# EasyEDA Pro project Project.eprj, board Backup
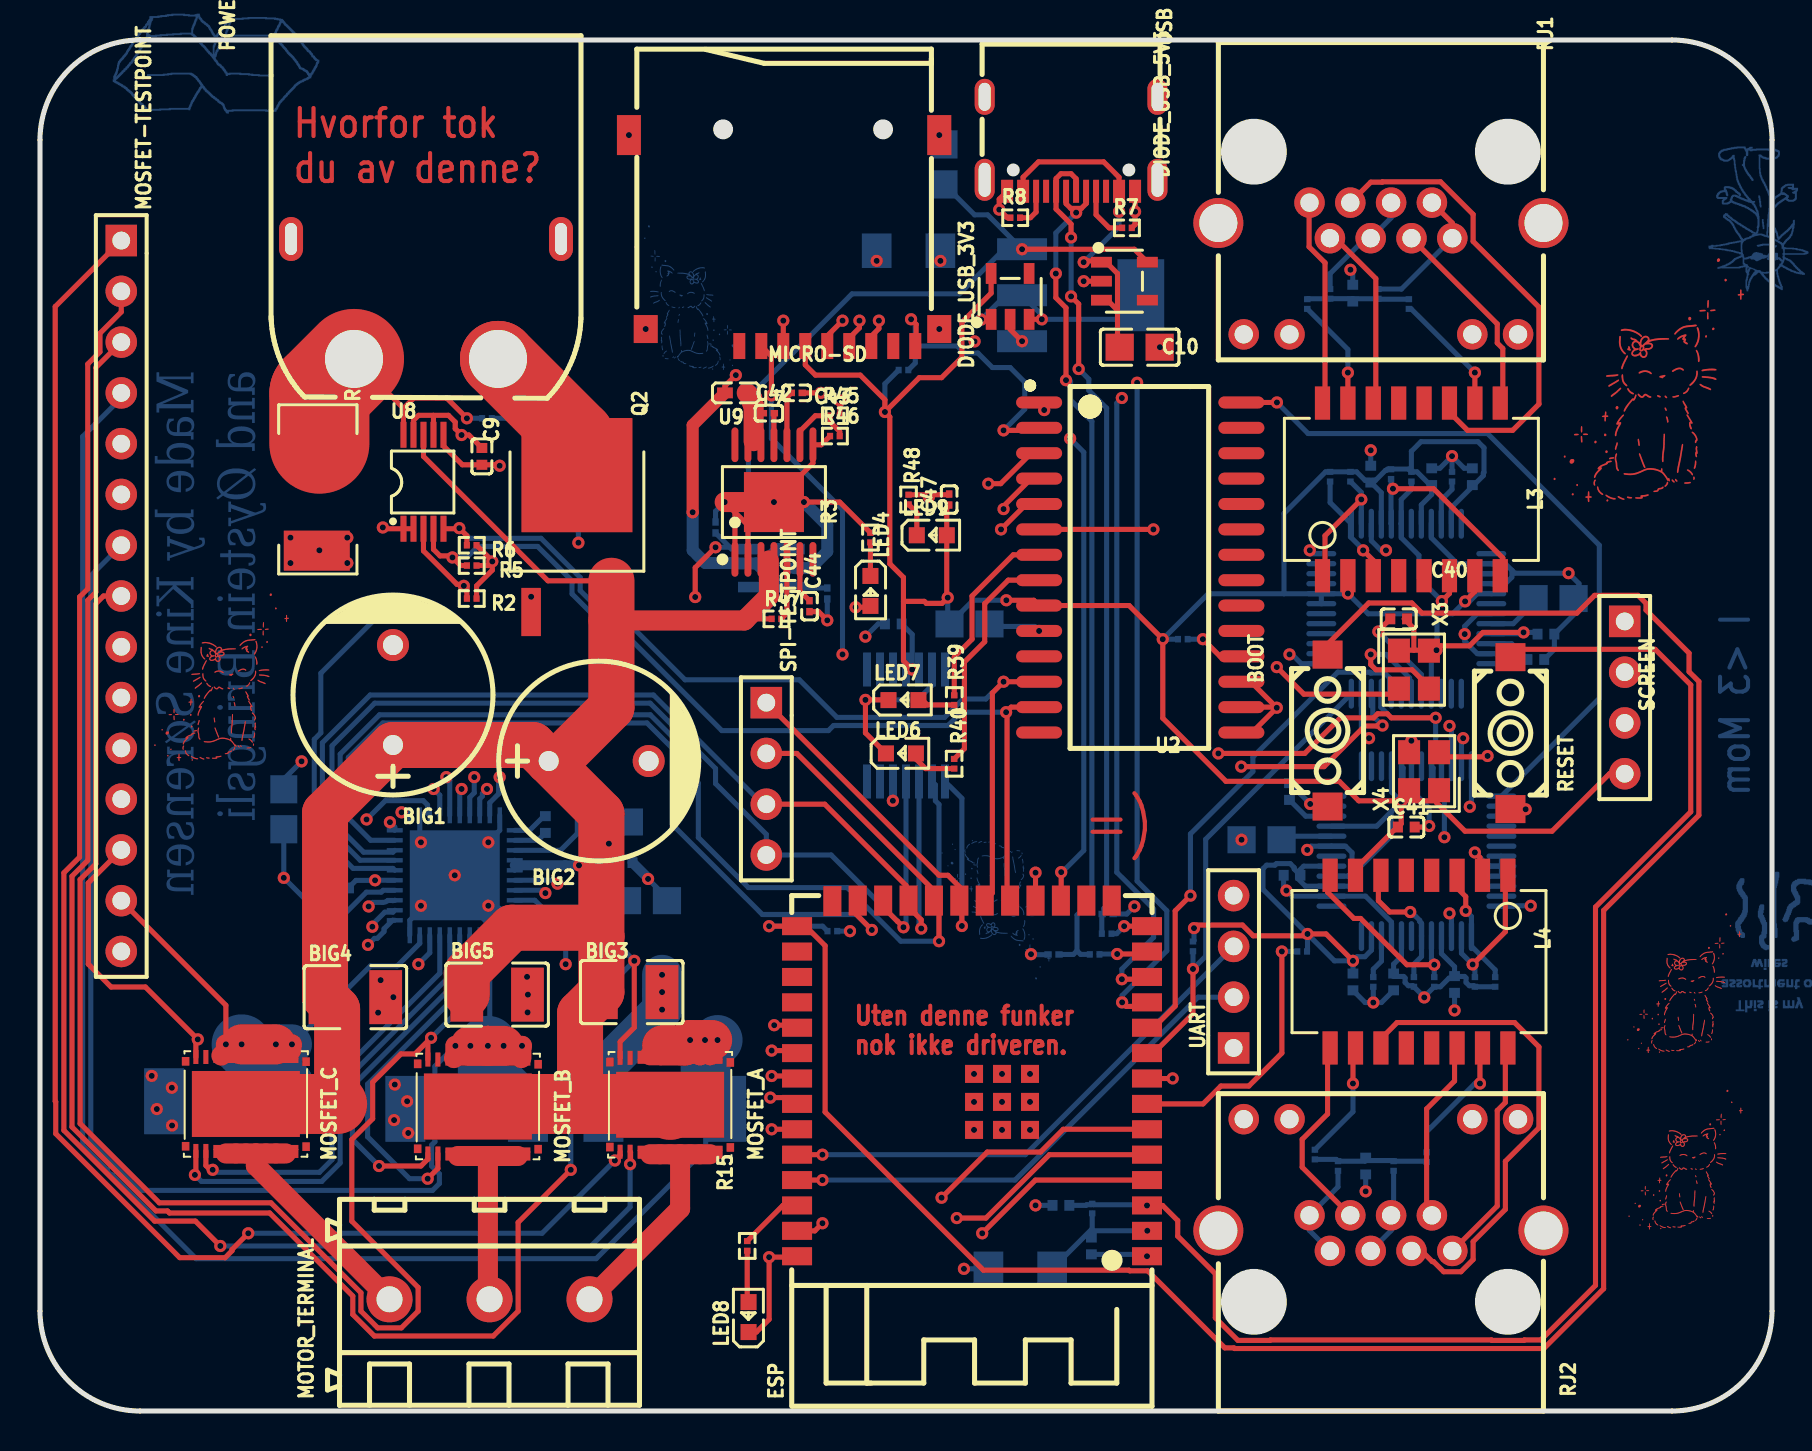
[diagram p5: board, top side]
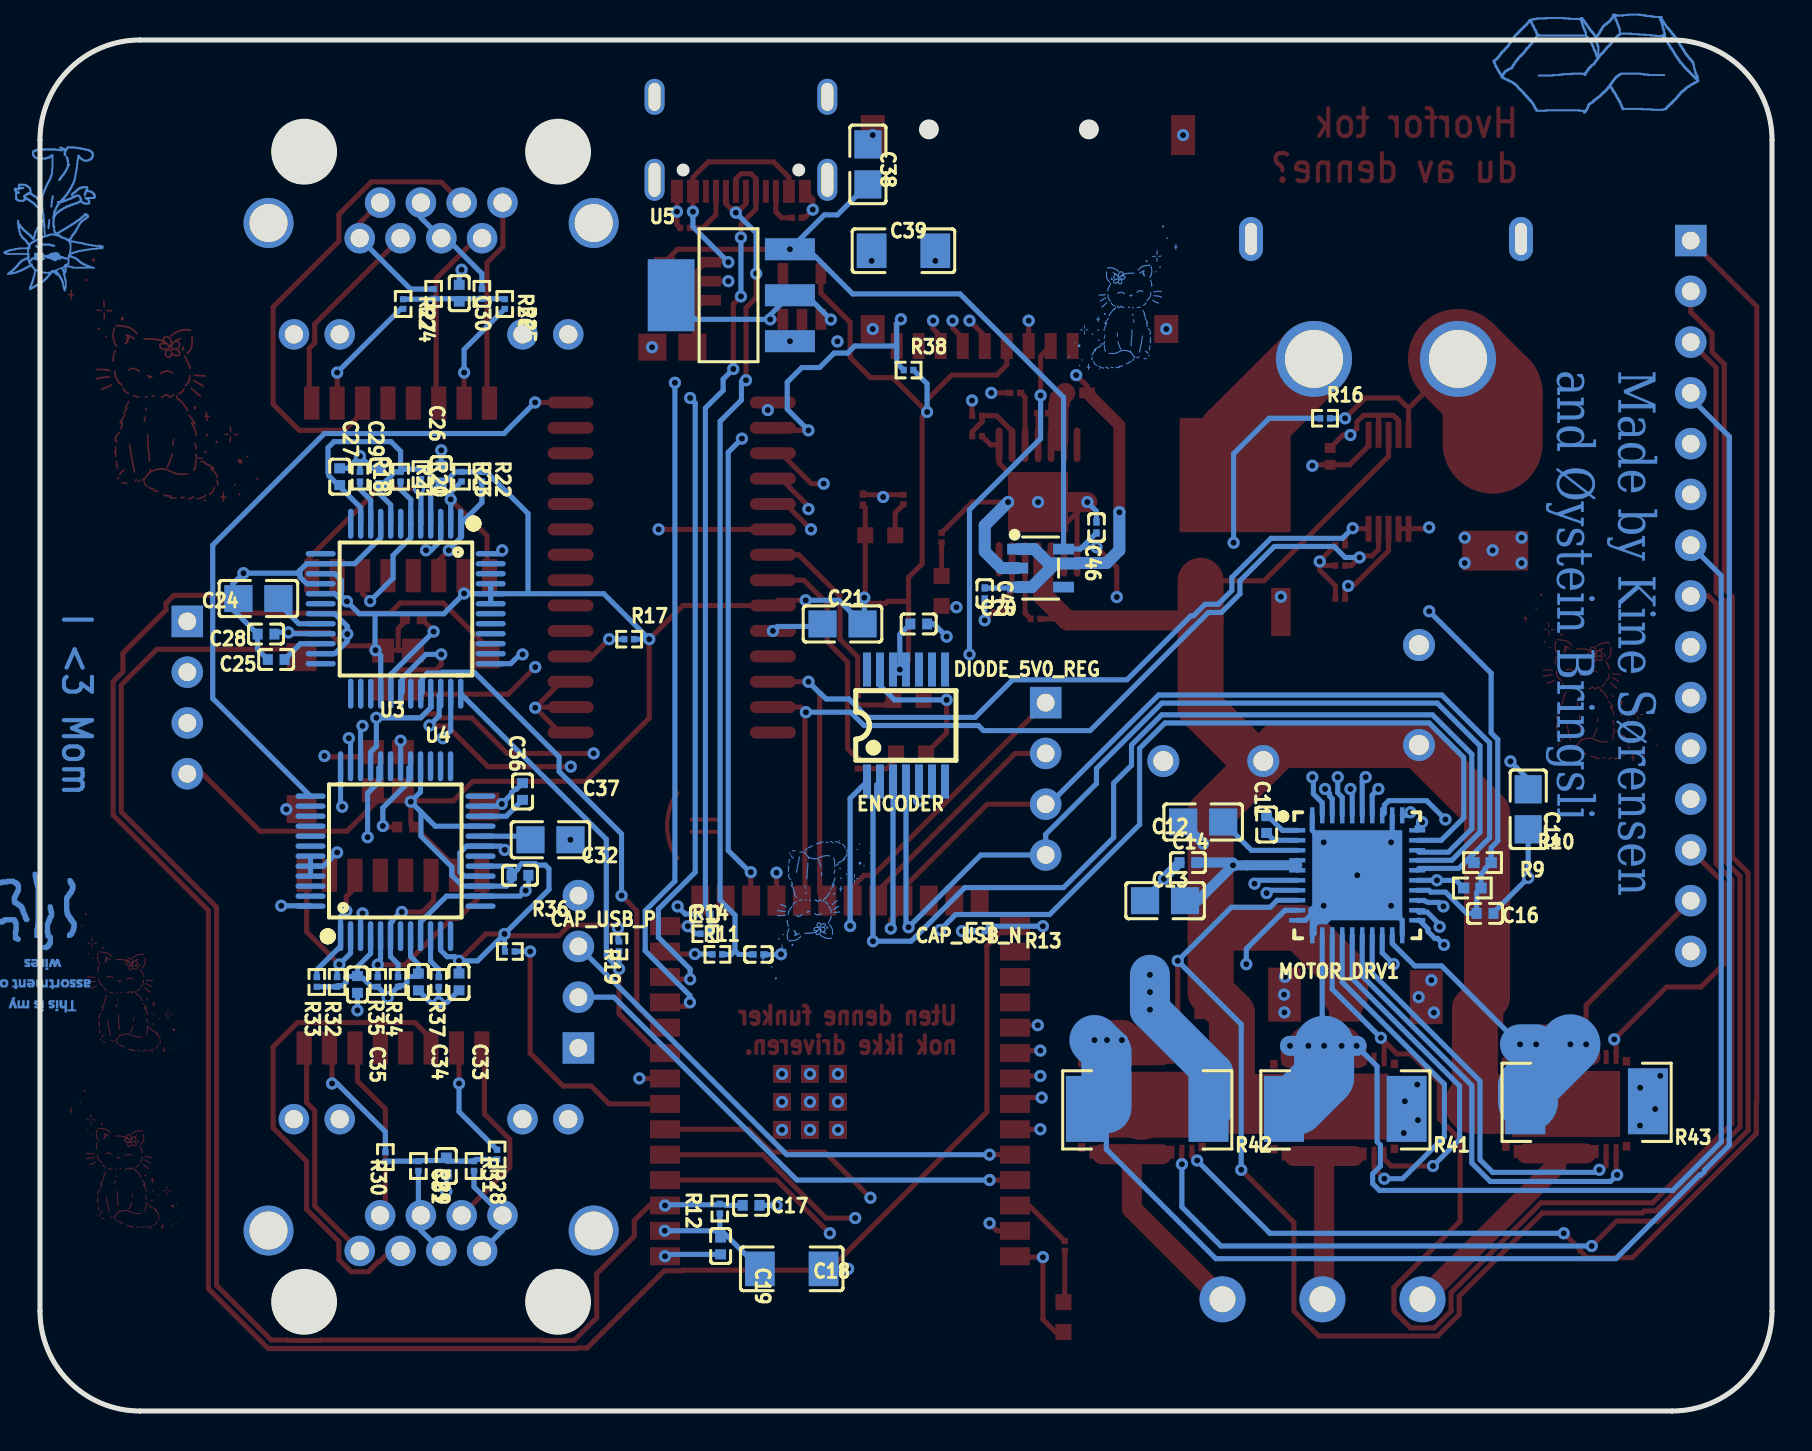
[diagram p6: board, bottom side, seen from below]

Outline 86.61 x 68.58 mm; copper layers: Top Layer, Inner1, Inner2, Bottom Layer. Coordinates in mm from the lower left corner of the outline.
Outline path: 0,63.58 0,5 arc(1.46,1.46) 5,0 81.61,0 arc(85.15,1.46) 86.61,5 86.61,63.58 arc(85.15,67.12) 81.61,68.58 5,68.58 arc(1.46,67.12) 0,63.58
Stack: Top Layer 0.035mm / Dielectric1 0.48mm PP er 4.5 / Inner1 0.035mm / Dielectric2 0.48mm FR4 er 4.5 / Inner2 0.035mm / Dielectric3 0.48mm PP er 4.5 / Bottom Layer 0.035mm

## Design rules (mm)
spacing Default (default): track to track 0.152, other pairs 0 to 0.152
track width Default (default): min 0.254, default 0.254, max 25.4
differential pair differentialPair (default): width min 0.127, default 0.254, max 2.54; gap min 0.152, default 0.152
via Default (default): diameter min 0.61, default 0.61, max 100.025; hole min 0.305, default 0.305, max 59.995

## Placement (name value [footprint] x y rotation side)
BIG1  470uF  [CAP-TH_BD10.0-P5.00-D0.6-FD_2]  17.65 35.81 90 top
BIG2  470uF  [CAP-TH_BD10.0-P5.00-D0.6-FD_2]  27.94 32.51 0 top
BIG3  10uF  [C1210]  29.59 20.95 180 top
BIG4  10uF  [C1210]  15.77 20.7 180 top
BIG5  10uF  [C1210]  22.86 20.83 180 top
BOOT  K2-3.6×6.1_SMD  [KEY-SMD_2P-L6.2-W3.6-LS8.0]  64.39 34.04 270 top
C9  0.1uF  [C0402]  22.1 47.75 270 top
C10  4.7uF  [C0805]  54.99 53.21 180 top
C11  47nF  [C0402]  25.27 29.34 270 bottom
C12  1uF  [C0805]  28.45 29.46 180 bottom
C13  10u  [C0805]  30.35 25.53 0 bottom
C14  0.1u  [C0402]  29.21 27.43 0 bottom
C15  1u  [C0805]  12.19 30.1 270 bottom
C16  0.1uF  [C0402]  14.35 24.89 0 bottom
C17  0.1uF  [C0402]  51.05 10.29 0 bottom
C18  22uF  [C1206]  49.02 7.11 0 bottom
C19  0.1uF  [C0402]  52.58 8.25 90 bottom
C20  0.1uF  [C0402]  42.67 39.37 0 bottom
C21  10uF  [C0805]  46.48 39.37 180 bottom
C24  4.7uF  [C0805]  75.69 40.64 180 bottom
C25  10nF  [C0402]  74.8 37.59 180 bottom
C26  0.1uF  [C0402]  66.55 46.86 270 bottom
C27  0.1uF  [C0402]  71.63 46.74 270 bottom
C28  0.1uF  [C0402]  75.31 38.86 180 bottom
C29  0.1uF  [C0402]  69.6 46.74 270 bottom
C30  1500pF  [C0402]  65.65 55.91 270 bottom
C31  1500pF  [C0402]  66.29 12.26 90 bottom
C32  0.1uF  [C0402]  62.61 26.8 0 bottom
C33  0.1uF  [C0402]  65.66 21.46 90 bottom
C34  0.1uF  [C0402]  67.69 21.46 90 bottom
C35  0.1uF  [C0402]  70.74 21.34 90 bottom
C36  10nF  [C0402]  62.48 30.99 270 bottom
C37  4.7uF  [C0805]  61.09 28.57 0 bottom
C38  10uF  [C0805]  45.21 62.36 270 bottom
C39  22uF  [C1206]  43.43 58.04 180 bottom
C40  0.01uF  [C0402]  67.95 39.62 180 top
C41  0.01uF  [C0402]  68.33 29.21 0 top
C42  100nF  [C0201]  36.45 49.91 0 top
C43  100nF  [C0201]  37.85 50.93 180 top
C44  10nF  [C0201]  38.48 40.26 270 top
C45  15uF  [C0201]  39.37 40.89 270 bottom
C46  100nF  [C0201]  33.78 44.2 90 bottom
C47  15uF  [C0201]  45.47 45.59 90 top
CAP_USB_N  NC  [C0201]  50.68 22.84 0 bottom
CAP_USB_P  NC  [C0201]  53.39 24.86 180 bottom
DIODE_5V0_REG  MAX40200AUK+T  [TSOT-23-5_L2.9-W1.6-P0.95-LS2.8-BL]  36.58 42.16 270 bottom
DIODE_USB_3V3  MAX40200AUK+T  [TSOT-23-5_L2.9-W1.6-P0.95-LS2.8-BL]  48.51 55.75 0 top
DIODE_USB_5V5  MAX40200AUK+T  [TSOT-23-5_L2.9-W1.6-P0.95-LS2.8-BL]  54.23 56.52 270 top
ENCODER  AS5048A-HTSP-500  [TSSOP-14_L5.0-W4.4-P0.65-LS6.4-BL]  43.31 34.29 180 bottom
ESP  ESP32-S3-WROOM-1(N16R8)  [WIRELM-SMD_ESP32-S3-WROOM-1]  46.61 16.64 180 top
L3  HX1188NLT  [RJ45-SMD_HX1188NLT]  68.58 46.1 90 top
L4  HX1188NLT  [RJ45-SMD_HX1188NLT]  68.96 22.48 270 top
L7  30uH  [L0402]  34.8 50.93 180 top
LED4  KT-0603YG  [LED0603-RD]  41.53 41.02 270 top
LED6  KT-0603YG  [LED0603-RD]  43.05 32.89 0 top
LED7  KT-0603YG  [LED0603-RD]  43.18 35.56 0 top
LED8  KT-0603YG  [LED0603-RD]  35.43 4.7 90 top
LED9  KT-0603YG  [LED0603-RD]  44.6 43.81 0 top
MICRO-SD  TF-01A  [TF-SMD_TF-01A]  37.21 58.55 180 top
MOSFET-TESTPOINT  HDR-F-2.54_1x15  [HDR-F-2.54_1X15]  4.06 40.77 270 top
MOSFET_A  CSD88599Q5DC  [SON-22_L5.0-W6.0-P0.50-CSD88599Q5DCT]  31.51 15.32 90 top
MOSFET_B  CSD88599Q5DC  [SON-22_L5.0-W6.0-P0.50-CSD88599Q5DCT]  21.9 15.23 90 top
MOSFET_C  CSD88599Q5DC  [SON-22_L5.0-W6.0-P0.50-CSD88599Q5DCT]  10.3 15.36 90 top
MOTOR_DRV1  DRV8323SRTAR  [WQFN-40_L6.0-W6.0-P0.50-TL-EP4.5]  20.74 26.8 180 bottom
MOTOR_TERMINAL  WJ128V-5.0-3P  [CONN-TH_3P-P5.00_WJ128V-5.0-3P]  22.48 5.59 0 top
POWER_INPUT  XT60PW-M  [CONN-TH_XT60PW-M]  19.3 55.63 270 top
Q2  SQD50P06-15L_GE3  [TO-252-2_L6.6-W6.1-P4.58-LS9.9-BR]  26.85 43.39 270 top
R2  4.7kΩ  [R0201]  21.59 40.64 0 top
R3  330Ω  [R0201]  41.53 43.69 270 top
R5  4.7kΩ  [R0201]  21.59 42.29 0 top
R6  4.7kΩ  [R0201]  21.59 43.31 0 top
R7  5.1kΩ  [R0201]  54.36 59.18 0 top
R8  5.1kΩ  [R0201]  48.77 59.69 180 top
R9  50kΩ  [R0402]  14.99 26.16 0 bottom
R10  50kΩ  [R0402]  14.48 27.43 0 bottom
R11  0Ω  [R0201]  52.74 22.84 0 bottom
R12  10kΩ  [R0201]  52.62 10.13 270 bottom
R13  10kΩ  [R0201]  39.62 24 0 bottom
R14  0Ω  [R0201]  53.34 23.88 0 bottom
R15  120  [R0201]  35.37 8.26 270 top
R16  100kΩ  [R0201]  22.35 49.66 180 bottom
R17  1kΩ  [R0201]  57.15 38.61 180 bottom
R18  12.4kΩ  [R0201]  70.61 46.74 90 bottom
R19  10kΩ  [R0201]  57.66 23.24 90 bottom
R20  49.9Ω  [R0201]  67.56 46.86 90 bottom
R21  49.9Ω  [R0201]  68.58 46.74 90 bottom
R22  49.9Ω  [R0201]  64.52 46.74 90 bottom
R23  49.9Ω  [R0201]  65.53 46.74 90 bottom
R24  75Ω  [R0201]  68.45 55.37 270 bottom
R25  75Ω  [R0201]  63.37 55.37 270 bottom
R26  75Ω  [R0201]  64.52 55.88 90 bottom
R27  75Ω  [R0201]  66.93 55.88 90 bottom
R28  75Ω  [R0201]  64.91 12.26 270 bottom
R29  75Ω  [R0201]  67.69 12.26 270 bottom
R30  75Ω  [R0201]  69.34 12.7 90 bottom
R31  75Ω  [R0201]  63.75 12.83 90 bottom
R32  49.9Ω  [R0201]  71.76 21.46 270 bottom
R33  49.9Ω  [R0201]  72.77 21.46 270 bottom
R34  49.9Ω  [R0201]  68.71 21.46 270 bottom
R35  49.9Ω  [R0201]  69.72 21.46 270 bottom
R36  10kΩ  [R0201]  63.12 22.99 0 bottom
R37  12.4kΩ  [R0201]  66.67 21.46 270 bottom
R38  10kΩ  [R0201]  43.18 52.07 180 bottom
R39  120  [R0201]  45.72 35.56 270 top
R40  120  [R0201]  45.72 32.38 270 top
R41  3.5mΩ  [RES-SMD_L6.4-W3.2-R2512]  21.34 15.11 0 bottom
R42  3.5mΩ  [RES-SMD_L6.4-W3.2-R2512]  31.24 15.11 0 bottom
R43  3.5mΩ  [RES-SMD_L6.4-W3.2-R2512]  9.27 15.49 0 bottom
R44  3.5mΩ  [RES-SMD_L6.4-W3.2-R2512]  13.84 46.1 270 top
R45  15K  [R0201]  39.75 49.78 0 top
R46  10K  [R0201]  39.75 48.77 0 top
R47  100K  [R0201]  36.83 39.62 0 top
R48  110Ω  [R0201]  43.43 45.59 270 top
RESET  K2-3.6×6.1_SMD  [KEY-SMD_2P-L6.2-W3.6-LS8.0]  73.53 33.91 90 top
RJ1  R-RJ45R08P-C000  [RJ45-TH_R-RJ45R08P-C000]  67.06 57.15 180 top
RJ2  R-RJ45R08P-C000  [RJ45-TH_R-RJ45R08P-C000]  67.06 11.3 0 top
SCREEN  HDR-F-2.54_1x4  [HDR-F-2.54_1X4]  79.25 35.69 270 top
SPI-TESTPOINT  HDR-F-2.54_1x4  [HDR-F-2.54_1X4]  36.32 31.62 270 top
U2  MCP23017-E/SO  [SOIC-28_L18.0-W7.5-P1.27-LS10.3-BL]  55.02 42.19 270 top
U3  W5500  [LQFP-48_L7.0-W7.0-P0.50-LS9.0-BL]  68.33 40.13 0 bottom
U4  W5500  [LQFP-48_L7.0-W7.0-P0.50-LS9.0-BL]  68.83 28 180 bottom
U5  AMS1117-3.3  [SOT-223-3_L6.5-W3.4-P2.30-LS7.0-BR]  52.08 55.81 180 bottom
U8  INA238AIDGSR  [VSSOP-10_L3.0-W3.0-P0.50-LS4.9-BL]  19.18 46.48 0 top
U9  LM5161PWPR  [HTSSOP-14_L5.0-W4.4-P0.65-LS6.4-BL-EP3.0]  36.7 45.47 0 top
UART  HDR-F-2.54_1x4  [HDR-F-2.54_1X4]  59.69 21.97 90 top
USB  TYPE-C16PIN  [USB-C-SMD_TYPE-C16PIN]  51.56 63.37 180 top
X3  25MHz  [OSC-SMD_4P-L2.5-W2.0-BL]  68.71 37.08 270 top
X4  25MHz  [OSC-SMD_4P-L2.5-W2.0-BL]  69.22 32 90 top

## Footprints (pads in the part's own frame, mm; a bottom-side part is the same pattern mirrored in y, then rotated)
C0201
  rect 0.368x0.324 smd: 1(-0.275,0) 2(0.275,0)
C0402
  rect 0.5x0.54 smd: 1(-0.42,0) 2(0.42,0)
C0805
  rect 1.41x1.35 smd: 1(-1,0) 2(1,0)
C1206
  rect 1.485x1.728 smd: 1(-1.593,0) 2(1.593,0)
C1210
  rect 1.635x2.7 smd: 1(-1.518,0) 2(1.518,0)
CAP-TH_BD10.0-P5.00-D0.6-FD_2
  round 1.6 hole 1: 1(-2.5,0) 2(2.5,0)
CONN-TH_3P-P5.00_WJ128V-5.0-3P
  round 2.3 hole 1.3: 1(-5,0) 2(0.003,0) 3(5,0)
CONN-TH_XT60PW-M
  round 3.8 hole 2.9: 1(3,-3.6) 2(3,3.6)
  oval 2.2x1.2 hole 1.6x0.6: 3(-3,6.75) 4(-3,-6.75)
HDR-F-2.54_1X4
  rect 1.575x1.575 hole 0.889: 1(-3.81,0)
  round 1.575 hole 0.889: 2(-1.27,0) 3(1.27,0) 4(3.81,0)
HDR-F-2.54_1X15
  rect 1.575x1.575 hole 0.889: 1(-17.78,0)
  round 1.575 hole 0.889: 2(-15.24,0) 3(-12.7,0) 4(-10.16,0) 5(-7.62,0) 6(-5.08,0) 7(-2.54,0) 8(0,0) 9(2.54,0) 10(5.08,0) 11(7.62,0) 12(10.16,0) 13(12.7,0) 14(15.24,0) 15(17.78,0)
HTSSOP-14_L5.0-W4.4-P0.65-LS6.4-BL-EP3.0
  oval 0.343x1.732 smd: 1(-1.95,-2.866) 2(-1.3,-2.866) 3(-0.65,-2.866) 4(0,-2.866) 5(0.65,-2.866) 6(1.3,-2.866) 7(1.95,-2.866) 8(1.95,2.866) 9(1.3,2.866) 10(0.65,2.866) 11(0,2.866) 12(-0.65,2.866) 13(-1.3,2.866) 14(-1.95,2.866)
  rect 3x3 smd: 15(0,0)
KEY-SMD_2P-L6.2-W3.6-LS8.0
  rect 1.4x1.5 smd: 1(-3.8,0) 2(3.8,0)
L0402
  rect 0.79x0.54 smd: 1(-0.545,0) 2(0.545,0)
LED0603-RD
  rect 0.8x0.8 smd: 1(-0.749,0) 2(0.749,0)
LQFP-48_L7.0-W7.0-P0.50-LS9.0-BL
  oval 0.27x1.5 smd: 1(-2.75,-4.25) 2(-2.25,-4.25) 3(-1.75,-4.25) 4(-1.25,-4.25) 5(-0.75,-4.25) 6(-0.25,-4.25) 7(0.25,-4.25) 8(0.75,-4.25) 9(1.25,-4.25) 10(1.75,-4.25) 11(2.25,-4.25) 12(2.75,-4.25) 25(2.75,4.25) 26(2.25,4.25) 27(1.75,4.25) 28(1.25,4.25) 29(0.75,4.25) 30(0.25,4.25) 31(-0.25,4.25) 32(-0.75,4.25) 33(-1.25,4.25) 34(-1.75,4.25) 35(-2.25,4.25) 36(-2.75,4.25)
  oval 1.5x0.27 smd: 13(4.25,-2.75) 14(4.25,-2.25) 15(4.25,-1.75) 16(4.25,-1.25) 17(4.25,-0.75) 18(4.25,-0.25) 19(4.25,0.25) 20(4.25,0.75) 21(4.25,1.25) 22(4.25,1.75) 23(4.25,2.25) 24(4.25,2.75) 37(-4.25,2.75) 38(-4.25,2.25) 39(-4.25,1.75) 40(-4.25,1.25) 41(-4.25,0.75) 42(-4.25,0.25) 43(-4.25,-0.25) 44(-4.25,-0.75) 45(-4.25,-1.25) 46(-4.25,-1.75) 47(-4.25,-2.25) 48(-4.25,-2.75)
OSC-SMD_4P-L2.5-W2.0-BL
  rect 1.2x1.1 smd: 1(-0.95,-0.75) 2(0.95,-0.75) 3(0.95,0.75) 4(-0.95,0.75)
R0201
  rect 0.303x0.324 smd: 1(-0.241,0) 2(0.241,0)
R0402
  rect 0.566x0.54 smd: 1(-0.433,0) 2(0.433,0)
RES-SMD_L6.4-W3.2-R2512
  rect 2x3.3 smd: 1(-3.067,0) 2(3.067,0)
RJ45-SMD_HX1188NLT
  rect 1.66x0.76 smd: 1(-4.318,4.445) 2(-4.318,3.175) 3(-4.318,1.905) 4(-4.318,0.635) 5(-4.318,-0.635) 6(-4.318,-1.905) 7(-4.318,-3.175) 8(-4.318,-4.445) 9(4.318,-4.445) 10(4.318,-3.175) 11(4.318,-1.905) 12(4.318,-0.635) 13(4.318,0.635) 14(4.318,1.905) 15(4.318,3.175) 16(4.318,4.445)
RJ45-TH_R-RJ45R08P-C000
  round 1.524 hole 0.914: 1(3.57,-3.295) 2(2.55,-1.515) 3(1.53,-3.295) 4(0.51,-1.515) 5(-0.51,-3.295) 6(-1.53,-1.515) 7(-2.55,-3.295) 8(-3.57,-1.515) 9(-6.86,3.295) 10(-4.57,3.295) 11(4.57,3.295) 12(6.86,3.295)
  round 2.5 hole 1.9: 13(8.13,-2.275) 14(-8.13,-2.275)
SOIC-28_L18.0-W7.5-P1.27-LS10.3-BL
  oval 0.6x2.3 smd: 1(-8.255,-5.058) 2(-6.985,-5.058) 3(-5.715,-5.058) 4(-4.445,-5.058) 5(-3.175,-5.058) 6(-1.905,-5.058) 7(-0.635,-5.058) 8(0.635,-5.058) 9(1.905,-5.058) 10(3.175,-5.058) 11(4.445,-5.058) 12(5.715,-5.058) 13(6.985,-5.058) 14(8.255,-5.058) 15(8.255,5.058) 16(6.985,5.058) 17(5.715,5.058) 18(4.445,5.058) 19(3.175,5.058) 20(1.905,5.058) 21(0.635,5.058) 22(-0.635,5.058) 23(-1.905,5.058) 24(-3.175,5.058) 25(-4.445,5.058) 26(-5.715,5.058) 27(-6.985,5.058) 28(-8.255,5.058)
SON-22_L5.0-W6.0-P0.50-CSD88599Q5DCT
  rect 0.7x0.25 smd: 1(-2.35,2.5) 2(-2.35,2) 21(2.35,2) 22(2.35,2.5)
  rect 0.45x0.25 smd: 3(-2.475,1.5) 4(-2.475,1) 5(-2.475,0.5) 6(-2.475,0) 7(-2.475,-0.5) 8(-2.475,-1) 9(-2.475,-1.5) 10(-2.475,-2) 11(-2.475,-2.5) 12(2.475,-2.5) 13(2.475,-2) 14(2.475,-1.5) 15(2.475,-1) 16(2.475,-0.5) 17(2.475,0) 18(2.475,0.5) 19(2.475,1) 20(2.475,1.5)
  rect 0.25x4.25 smd: 11(-2.175,-0.5) 20(2.175,-0.5)
  rect 0.43x0.375 smd: 23(-2.115,3.013) 24(-2.135,-3.013) 25(2.115,-3.013) 26(2.135,3.013)
  rect 3.3x5.4 smd: 27(0,0)
SOT-223-3_L6.5-W3.4-P2.30-LS7.0-BR
  rect 2.5x1.1 smd: 1(2.97,-2.3) 2(2.97,0) 3(2.97,2.3)
  rect 2.34x3.6 smd: 4(-2.97,0)
TF-SMD_TF-01A
  rect 0.6x1.3 smd: 1(2.24,5.276) 2(1.14,5.276) 3(0.04,5.276) 4(-1.06,5.276) 5(-2.16,5.276) 6(-3.26,5.276) 7(-4.36,5.276) 8(-5.46,5.276) 9(-6.56,5.276)
  rect 1.2x1.4 smd: 10(-7.76,4.426) 13(6.92,4.426)
  rect 1.2x2 smd: 11(-7.76,-5.276) 12(7.76,-5.276)
TO-252-2_L6.6-W6.1-P4.58-LS9.9-BR
  rect 2.409x0.979 smd: 1(3.424,-2.29) 3(3.424,2.29)
  rect 5.711x5.548 smd: 2(-3.424,0)
TSOT-23-5_L2.9-W1.6-P0.95-LS2.8-BL
  rect 0.532x1.045 smd: 1(-0.95,-1.147) 2(0,-1.147) 3(0.95,-1.147) 4(0.95,1.147) 5(-0.95,1.147)
TSSOP-14_L5.0-W4.4-P0.65-LS6.4-BL
  rect 0.4x1.7 smd: 1(-1.95,-2.8) 2(-1.3,-2.8) 3(-0.65,-2.8) 4(0,-2.8) 5(0.65,-2.8) 6(1.3,-2.8) 7(1.95,-2.8) 8(1.95,2.8) 9(1.3,2.8) 10(0.65,2.8) 11(0,2.8) 12(-0.65,2.8) 13(-1.3,2.8) 14(-1.95,2.8)
USB-C-SMD_TYPE-C16PIN
  oval 1x2.1 hole 0.6x1.7: 1(-4.32,1.788) 2(4.32,1.788)
  oval 1x1.8 hole 0.6x1.4: 3(-4.32,-2.362) 4(4.32,-2.362)
  rect 0.6x1.15 smd: A1B12(-3.2,2.362) A4B9(-2.4,2.362) B1A12(3.2,2.362) B4A9(2.4,2.362)
  rect 0.3x1.15 smd: A5(-1.25,2.362) A6(-0.25,2.362) A7(0.25,2.362) A8(1.25,2.362) B5(1.75,2.362) B6(0.75,2.362) B7(-0.75,2.362) B8(-1.75,2.362)
VSSOP-10_L3.0-W3.0-P0.50-LS4.9-BL
  rect 0.3x1.3 smd: 1(-1,-2.35) 2(-0.5,-2.35) 3(0,-2.35) 4(0.5,-2.35) 5(1,-2.35) 6(1,2.35) 7(0.5,2.35) 8(0,2.35) 9(-0.5,2.35) 10(-1,2.35)
WIRELM-SMD_ESP32-S3-WROOM-1
  rect 1.5x0.9 smd: 1(-8.75,8.895) 2(-8.75,7.625) 3(-8.75,6.355) 4(-8.75,5.085) 5(-8.75,3.815) 6(-8.75,2.545) 7(-8.75,1.275) 8(-8.75,0.005) 9(-8.75,-1.265) 10(-8.75,-2.535) 11(-8.75,-3.805) 12(-8.75,-5.075) 13(-8.75,-6.345) 14(-8.75,-7.615) 27(8.75,-7.615) 28(8.75,-6.345) 29(8.75,-5.075) 30(8.75,-3.805) 31(8.75,-2.535) 32(8.75,-1.265) 33(8.75,0.005) 34(8.75,1.275) 35(8.75,2.545) 36(8.75,3.815) 37(8.75,5.085) 38(8.75,6.355) 39(8.75,7.625) 40(8.75,8.895)
  rect 0.9x1.5 smd: 15(-6.985,-8.895) 16(-5.715,-8.895) 17(-4.445,-8.895) 18(-3.175,-8.895) 19(-1.905,-8.895) 20(-0.635,-8.895) 21(0.635,-8.895) 22(1.905,-8.895) 23(3.175,-8.895) 24(4.445,-8.895) 25(5.715,-8.895) 26(6.985,-8.865)
  rect 0.9x0.9 smd: 41(-2.9,2.575) 41(-2.9,1.175) 41(-2.9,-0.225) 41(-1.5,2.575) 41(-1.5,1.175) 41(-1.5,-0.225) 41(-0.1,2.575) 41(-0.1,1.175) 41(-0.1,-0.225)
WQFN-40_L6.0-W6.0-P0.50-TL-EP4.5
  rect 0.8x0.22 smd: 1(-3,2.25) 2(-3,1.75) 3(-3,1.25) 4(-3,0.75) 5(-3,0.25) 6(-3,-0.25) 7(-3,-0.75) 8(-3,-1.25) 9(-3,-1.75) 10(-3,-2.25) 21(3,-2.25) 22(3,-1.75) 23(3,-1.25) 24(3,-0.75) 25(3,-0.25) 26(3,0.25) 27(3,0.75) 28(3,1.25) 29(3,1.75) 30(3,2.25)
  rect 0.22x0.8 smd: 11(-2.25,-3) 12(-1.75,-3) 13(-1.25,-3) 14(-0.75,-3) 15(-0.25,-3) 16(0.25,-3) 17(0.75,-3) 18(1.25,-3) 19(1.75,-3) 20(2.25,-3) 31(2.25,3) 32(1.75,3) 33(1.25,3) 34(0.75,3) 35(0.25,3) 36(-0.25,3) 37(-0.75,3) 38(-1.25,3) 39(-1.75,3) 40(-2.25,3)
  rect 4.5x4.5 smd: 41(0,0)

## Nets
3V3: C9.2 C16.2 C18.2 C19.2 C20.2 C21.2 C26.2 C27.2 C28.2 C29.2 C32.2 C33.2 C34.2 C35.2 C40.1 C41.1 C47.1 DIODE_USB_3V3.5 ENCODER.11 ENCODER.12 ESP.2 L3.2 L3.7 L4.2 L4.7 LED9.2 MICRO-SD.4 MOTOR_DRV1.24 R2.2 R5.2 R6.2 R9.1 R10.1 R12.2 R13.2 R17.2 R19.2 R20.2 R21.2 R22.2 R23.2 R32.2 R33.2 R34.2 R35.2 R36.2 R38.2 SCREEN.4 U2.9 U3.4 U3.8 U3.11 U3.15 U3.17 U3.21 U3.28 U3.43 U3.44 U3.45 U4.4 U4.8 U4.11 U4.15 U4.17 U4.21 U4.28 U4.43 U4.44 U4.45 U8.6 UART.1 X3.1 X3.4 X4.1 X4.4
5V0: C38.2 C46.1 DIODE_5V0_REG.5 DIODE_USB_5V5.5 LED4.2 U5.3
5V0-RAW: C45.1 DIODE_5V0_REG.1 DIODE_5V0_REG.3 L7.2 R45.2
5V0_USB: C10.2 DIODE_USB_5V5.1 DIODE_USB_5V5.3 USB.A4B9 USB.B4A9
GND: BIG1.2 BIG2.2 BIG3.1 BIG4.1 BIG5.1 BOOT.2 C9.1 C10.1 C13.2 C14.2 C15.2 C16.1 C17.1 C18.1 C19.1 C20.1 C21.1 C24.1 C25.1 C26.1 C27.1 C28.1 C29.1 C30.1 C31.1 C32.1 C33.1 C34.1 C35.1 C36.1 C37.1 C38.1 C39.2 C40.2 C41.2 C43.1 C44.2 C45.2 C46.2 C47.2 CAP_USB_N.1 CAP_USB_P.1 DIODE_5V0_REG.2 DIODE_USB_3V3.2 DIODE_USB_5V5.2 ENCODER.5 ENCODER.13 ESP.1 ESP.40 ESP.41 LED6.1 LED7.1 LED8.1 MICRO-SD.6 MICRO-SD.10 MICRO-SD.11 MICRO-SD.12 MICRO-SD.13 MOSFET-TESTPOINT.5 MOSFET-TESTPOINT.6 MOSFET-TESTPOINT.15 MOTOR_DRV1.10 MOTOR_DRV1.11 MOTOR_DRV1.20 MOTOR_DRV1.32 MOTOR_DRV1.40 MOTOR_DRV1.41 R3.1 R7.2 R8.2 R18.2 R37.2 R41.1 R42.1 R43.1 R44.2 R46.1 R48.1 RESET.1 RJ1.13 RJ1.14 RJ2.13 RJ2.14 SCREEN.3 U2.10 U2.15 U2.16 U2.17 U3.3 U3.9 U3.14 U3.16 U3.19 U3.23 U3.29 U3.48 U4.3 U4.9 U4.14 U4.16 U4.19 U4.23 U4.29 U4.48 U5.1 U8.1 U8.2 U8.7 U8.9 U9.1 U9.2 U9.8 U9.15 UART.4 USB.A1B12 USB.B1A12 X3.2 X4.2
VIN: BIG1.1 BIG2.1 BIG3.2 BIG4.2 BIG5.2 C12.1 C13.1 C14.1 MOSFET_A.27 MOSFET_B.27 MOSFET_C.27 MOTOR_DRV1.4 MOTOR_DRV1.5 Q2.3 R47.1 U8.8 U9.3 U9.4
CAL_M: MOTOR_DRV1.31 U2.5
CS-SD: ESP.18 MICRO-SD.2
CS_ENCODER: ENCODER.1 ESP.21 SPI-TESTPOINT.1
CS_MDRV: ESP.25 MOTOR_DRV1.29
CS_W5500_0: ESP.10 U3.32
CS_W5500_1: ESP.8 U4.32
ENABLE_M: MOTOR_DRV1.30 U2.4
ETHERNET_INT_0: ESP.9 R19.1 U3.36
ETHERNET_INT_1: ESP.7 R36.1 U4.36
ETHERNET_RESET_0: U2.6 U3.37
ETHERNET_RESET_1: U2.28 U4.37
I2C-SCL: ESP.20 R6.1 SCREEN.1 U2.12 U8.5
I2C-SDA: ESP.19 R5.1 SCREEN.2 U2.13 U8.4
IN_MHIGH_A: ESP.39 MOTOR_DRV1.34
IN_MHIGH_B: ESP.34 MOTOR_DRV1.36
IN_MHIGH_C: ESP.32 MOTOR_DRV1.38
IN_MLOW_A: ESP.35 MOTOR_DRV1.35
IN_MLOW_B: ESP.33 MOTOR_DRV1.37
IN_MLOW_C: ESP.31 MOTOR_DRV1.39
INA-ALERT: R2.1 U2.1 U8.3
NFAULT_M: MOTOR_DRV1.25 R9.2 U2.3
RXN_0: L3.8 R20.1 U3.5
RXN_1: L4.8 R35.1 U4.5
RXP_0: L3.6 R21.1 U3.6
RXP_1: L4.6 R34.1 U4.6
SD-CD: MICRO-SD.9 R38.1 U2.2
SOA_M: ESP.6 MOTOR_DRV1.23
SOB_M: ESP.5 MOTOR_DRV1.22
SOC_M: ESP.4 MOTOR_DRV1.21
SPI_CLK_0: ENCODER.2 ESP.22 MOTOR_DRV1.28 SPI-TESTPOINT.2
SPI_CLK_1: ESP.12 MICRO-SD.5 U3.33 U4.33
SPI_MISO_0: ENCODER.3 ESP.23 MOTOR_DRV1.26 R10.2 SPI-TESTPOINT.3
SPI_MISO_1: ESP.11 MICRO-SD.7 U3.34 U4.34
SPI_MOSI_0: ENCODER.4 ESP.24 MOTOR_DRV1.27 SPI-TESTPOINT.4
SPI_MOSI_1: ESP.17 MICRO-SD.3 U3.35 U4.35
TXN_0: L3.3 R22.1 U3.1
TXN_1: L4.3 R33.1 U4.1
TXP_0: L3.1 R23.1 U3.2
TXP_1: L4.1 R32.1 U4.2
USB_NEG: CAP_USB_N.2 R11.1 USB.A7 USB.B7
USB_POS: CAP_USB_P.2 R14.1 USB.A6 USB.B6
$1N21: POWER_INPUT.1 R16.2 R44.1 U8.10
$1N28: R8.1 USB.B5
$1N29: R7.1 USB.A5
$1N46: C39.1 DIODE_USB_3V3.1 DIODE_USB_3V3.3 U5.2 U5.4
$1N52: POWER_INPUT.2 Q2.2
$1N53: Q2.1 R16.1
$1N3919: LED4.1 R3.2
$1N8597: C42.2 U9.11
$1N8601: C42.1 L7.1 U9.12 U9.13
$1N8664: C43.2 U9.10
$1N8745: R45.1 R46.2 U9.9
$1N8854: R47.2 U9.5
$1N8916: C44.1 U9.6
$1N9309: LED9.1 R48.2
$2N19: C15.1 MOTOR_DRV1.33
$2N21: C11.2 MOTOR_DRV1.2
$2N22: C11.1 MOTOR_DRV1.1
$2N24: MOSFET-TESTPOINT.14 MOSFET_C.12 MOSFET_C.13 MOSFET_C.14 MOSFET_C.15 MOSFET_C.16 MOSFET_C.17 MOSFET_C.18 MOSFET_C.19 MOSFET_C.20 MOTOR_DRV1.19 R43.2
$2N25: MOSFET-TESTPOINT.11 MOSFET_C.1 MOTOR_DRV1.16
$2N26: MOSFET-TESTPOINT.10 MOSFET_B.1 MOTOR_DRV1.15
$2N27: MOSFET-TESTPOINT.9 MOSFET_B.2 MOTOR_DRV1.14
$2N28: MOSFET-TESTPOINT.8 MOSFET_B.22 MOTOR_DRV1.13
$2N29: MOSFET-TESTPOINT.7 MOSFET_B.12 MOSFET_B.13 MOSFET_B.14 MOSFET_B.15 MOSFET_B.16 MOSFET_B.17 MOSFET_B.18 MOSFET_B.19 MOSFET_B.20 MOTOR_DRV1.12 R41.2
$2N31: MOSFET-TESTPOINT.4 MOSFET_A.12 MOSFET_A.13 MOSFET_A.14 MOSFET_A.15 MOSFET_A.16 MOSFET_A.17 MOSFET_A.18 MOSFET_A.19 MOSFET_A.20 MOTOR_DRV1.9 R42.2
$2N32: MOSFET-TESTPOINT.3 MOSFET_A.22 MOTOR_DRV1.8
$2N33: MOSFET-TESTPOINT.2 MOSFET_A.2 MOTOR_DRV1.7
$2N34: MOSFET-TESTPOINT.1 MOSFET_A.1 MOTOR_DRV1.6
$2N35: MOSFET_A.3 MOSFET_A.4 MOSFET_A.5 MOSFET_A.6 MOSFET_A.7 MOSFET_A.8 MOSFET_A.9 MOSFET_A.10 MOSFET_A.11 MOTOR_TERMINAL.3
$2N36: MOSFET_B.3 MOSFET_B.4 MOSFET_B.5 MOSFET_B.6 MOSFET_B.7 MOSFET_B.8 MOSFET_B.9 MOSFET_B.10 MOSFET_B.11 MOTOR_TERMINAL.2
$2N37: MOSFET_C.3 MOSFET_C.4 MOSFET_C.5 MOSFET_C.6 MOSFET_C.7 MOSFET_C.8 MOSFET_C.9 MOSFET_C.10 MOSFET_C.11 MOTOR_TERMINAL.1
$2N47: MOSFET-TESTPOINT.12 MOSFET_C.2 MOTOR_DRV1.17
$2N48: MOSFET-TESTPOINT.13 MOSFET_C.22 MOTOR_DRV1.18
$2N493: C12.2 MOTOR_DRV1.3
$3N13: ESP.14 R14.2
$3N14: ESP.13 R11.2
$3N15: C17.2 ESP.3 R12.1 RESET.2
$3N36: BOOT.1 ESP.27 R13.1
$3N37: ESP.38 R15.1
$3N47: R17.1 U2.18
$3N65: ESP.37 UART.2
$3N66: ESP.36 UART.3
$3N2328: R39.1 U2.7
$3N2443: R40.1 U2.8
$3N5555: LED6.2 R40.2
$3N5557: LED7.2 R39.2
$3N5605: LED8.2 R15.2
$4N13: U3.25
$4N14: U3.26
$4N15: U3.27
$4N31: L3.10 R24.2
$4N32: C30.2 R24.1 R25.1 R26.1 R27.1
$4N33: L3.15 R25.2
$4N35: R27.2 RJ1.7 RJ1.8
$4N36: L3.9 RJ1.6
$4N37: R26.2 RJ1.4 RJ1.5
$4N38: L3.11 RJ1.3
$4N39: L3.14 RJ1.2
$4N40: L3.16 RJ1.1
$4N43: U3.24
$4N550: R18.1 U3.10
$4N551: C24.2 U3.20
$4N552: C25.2 U3.22
$4N1114: U3.30 X3.3
$5N3: U4.24
$5N6: L4.16 RJ2.1
$5N7: L4.14 RJ2.2
$5N8: L4.11 RJ2.3
$5N9: R29.2 RJ2.4 RJ2.5
$5N10: L4.9 RJ2.6
$5N11: R28.2 RJ2.7 RJ2.8
$5N12: C31.2 R28.1 R29.1 R30.1 R31.1
$5N15: L4.15 R30.2
$5N17: L4.10 R31.2
$5N34: U4.27
$5N35: U4.26
$5N36: U4.25
$5N556: C36.2 U4.22
$5N557: C37.2 U4.20
$5N558: R37.1 U4.10
$5N1145: U4.30 X4.3

Pads without a net: DIODE_5V0_REG 4; DIODE_USB_3V3 4; DIODE_USB_5V5 4; ENCODER 6 7 8 9 10 14; ESP 15 16 26 28 29 30; L3 4 5 12 13; L4 4 5 12 13; MICRO-SD 1 8; MOSFET_A 21 23 24 25 26; MOSFET_B 21 23 24 25 26; MOSFET_C 21 23 24 25 26; POWER_INPUT 3 4; RJ1 9 10 11 12; RJ2 9 10 11 12; U2 11 14 19 20 21 22 23 24 25 26 27; U3 7 12 13 18 31 38 39 40 41 42 46 47; U4 7 12 13 18 31 38 39 40 41 42 46 47; U9 7 14; USB 1 2 3 4 A8 B8

## Via types
v1: diameter 0.61, hole 0.305, Top Layer to Bottom Layer, 249 vias

## Routing (per net, layer and track width the routed paths; a pad name or vN(x,y) marks a point on that pad's centre or on a via; arc(x,y) is an arc through that point)
3V3: length 334.2
  Top Layer w0.254: v1(22.62,42.49) 22.62,42.06 21.83,41.27 R2.2 ; v1(22.62,42.49) 22.42,42.29 R5.2 ; v1(22.62,42.49) 22.62,42.52 R6.2 ; v1(74.19,38.95) 72.16,38.95 71.49,38.28 70.06,38.28 v1(69.84,38.06) 68.7,38.06 ; 72.01,26.29 72.01,27.69 v1(71.76,27.94) ; 43.18,40.5 43.18,37.53 v1(43.62,37.09) ; 43.18,40.5 44.22,40.5 44.32,40.4 45.11,40.4 v1(45.39,40.69) 45.35,40.73 LED9.2 45.35,45.2 C47.1 ; 43.18,40.5 43.18,41.7 42.5,42.38 42.5,49.73 v1(42.25,49.97) ; SCREEN.4 78.49,31.88 75.61,29 71.26,29 69.84,30.43 69.84,30.52 65.95,30.52 64.97,31.5 59.31,31.5 56.15,34.66 v1(56.15,38.61) 54.47,40.29 U2.9 49.7,40.55 v1(48.32,40.55) ; L3.7 71.76,40.99 v1(71.27,40.5) ; L4.7 65.79,27.13 67.89,29.23 67.91,29.21 68.07,29.38 v1(68.07,30.48) ; v1(57.71,24.15) 57.86,24.31 60.13,24.31 60.67,23.77 63.3,23.77 v1(63.39,23.86) 64.31,23.86 v1(65.66,22.52) ; v1(22.99,47.28) 22.94,47.33 C9.2 21.12,47.33 20.18,48.28 U8.6 ; v1(42.25,49.97) 43.97,51.69 45.08,51.69 46.1,52.7 46.1,54.46 47.56,55.92 DIODE_USB_3V3.5 ; v1(42.25,49.97) 42.25,50.58 41.02,51.82 38.78,51.82 38.27,52.32 MICRO-SD.4 ; 68.7,38.06 68.7,39.14 68.22,39.62 ; 68.7,38.06 68.09,38.06 ; v1(65.41,40.89) L3.2
  Inner2 w0.254: v1(42.25,49.97) 42.07,49.79 41.44,49.79 39.43,47.79 23.49,47.79 v1(22.99,47.28) 22.99,42.86 v1(22.62,42.49) 21.59,42.49 19.1,40 v1(17.15,40) ; v1(71.76,27.94) 71.88,27.81 71.88,23.4 69.22,20.74 v1(69.22,20.69) 67.39,22.52 v1(65.66,22.52) 64.81,22.52 63.37,21.08 62.61,21.08 UART.1 59.69,15.88 58.93,15.11 58.93,12.57 v1(55.37,9.02) 48.01,9.02 42.67,14.35 42.67,21.84 v1(40.51,24)
  Bottom Layer w0.254: v1(55.37,9.02) 52.68,9.02 52.62,9.08 ; C28.2 74.81,38.95 v1(74.19,38.95) 74.13,38.88 U3.21 ; v1(63.39,23.86) 64.73,22.52 v1(65.66,22.52) ; v1(63.39,23.86) 63.39,23.01 R36.2 ; v1(63.39,23.86) 61.16,26.09 61.16,27.13 61.34,27.3 61.76,27.3 61.83,27.38 62.52,27.38 62.72,27.18 62.72,27.11 62.89,26.94 ; U4.11 66.58,23.05 66.26,22.72 65.87,22.72 v1(65.66,22.52) ; 52.62,9.08 52.58,9.08 C18.2 ; 52.62,9.08 R12.2 ; R13.2 v1(40.51,24) ; U4.8 68.08,22.74 67.69,22.35 67.69,21.74 68.19,21.74 68.27,21.66 68.27,21.44 68.43,21.27 68.66,21.27 R34.2 69.22,20.71 R35.2 70.03,21.22 70.46,21.65 70.65,21.65 70.74,21.74 ; U3.17 72.56,40.89 71.89,40.89 71.49,40.5 v1(71.27,40.5) ; U3.4 67.08,45.93 66.55,46.46 ; U3.8 69.08,45.33 69.6,45.85 69.6,46.24 68.86,46.98 R21.2 ; 62.89,26.94 63.2,27.25 U4.17 ; U3.44 65.39,40.88 v1(65.41,40.89) 66.42,39.88 69.86,39.88 ; U3.44 U3.43 ; U3.44 62.21,40.88 ; U3.44 U3.45 ; 70.74,21.74 71.24,21.74 71.31,21.66 71.31,21.44 71.48,21.27 71.7,21.27 R32.2 R33.2 ; 70.74,21.74 70.74,22.22 70.08,22.88 U4.4 ; 62.89,26.94 62.89,26.65 63.28,26.25 U4.15 65.48,26.25 66.02,26.79 66.02,27.22 67.56,28.76 67.56,29.97 ; 62.89,26.94 C32.2 ; 67.56,29.97 66.85,29.25 U4.21 ; 67.56,29.97 v1(68.07,30.48) 67.58,30.97 U4.28 ; U3.28 69.58,37.8 v1(69.84,38.06) 69.86,38.08 69.86,39.88 ; MOTOR_DRV1.24 17.16,26.05 17.06,25.95 16.32,25.95 15.26,24.89 C16.2 14.77,25.94 R9.1 14.55,26.84 14.35,27.05 14.35,27.13 R10.1 14.05,28.18 13.72,28.51 13.72,33.59 14.05,33.92 14.05,36.9 v1(17.15,40) ; 66.55,46.46 66.46,46.55 66.27,46.55 65.84,46.98 R23.2 R22.2 64.29,46.98 62.21,44.9 62.21,40.88 ; 66.55,46.46 66.63,46.55 66.78,46.55 67.29,47.05 67.33,47.05 67.4,47.12 68.44,47.12 R21.2 ; v1(65.66,22.52) C33.2 ; U3.11 70.58,45.19 72.18,46.79 72.18,46.92 72.21,46.95 72.21,48.18 71.91,48.49 69.06,48.49 68.58,48.01 R21.2 ; v1(45.39,40.69) 45.39,39.46 C21.2 46.67,40.55 v1(48.32,40.55) ; U3.15 71.88,41.88 71.55,41.55 71.55,40.78 v1(71.27,40.5) ; R38.2 42.25,51.38 v1(42.25,49.97) ; R19.2 57.71,23.53 v1(57.71,24.15) ; v1(71.27,40.5) 70.64,39.88 69.86,39.88 ; 62.21,40.88 58.42,40.88 56.15,38.61 R17.2 ; U4.44 72.44,27.25 v1(71.76,27.94) ; U4.44 U4.43 ; U4.44 U4.45 ; ENCODER.11 43.31,37.4 v1(43.62,37.09) 43.62,38.85 C20.2
5V0: length 50.7
  Top Layer w0.254: v1(33.78,43.2) 32.77,42.19 v1(32.77,40.72) ; v1(49.11,58.11) 54.73,58.11 DIODE_USB_5V5.5 ; v1(40.79,40.21) 41.46,40.21 LED4.2
  Inner2 w0.254: v1(32.77,40.72) 33.28,40.21 v1(40.79,40.21)
  Bottom Layer w0.254: C46.1 34.5,43.2 ; 34.5,43.2 v1(33.78,43.2) ; 34.5,43.2 34.59,43.11 DIODE_5V0_REG.5 35.43,50.7 40.61,55.88 45.97,55.88 48.21,58.11 v1(49.11,58.11) 47.39,59.83 46.74,59.83 C38.2
5V0-RAW: length 26.1
  Top Layer w0.254: v1(34.8,51.82) 34.25,51.27 L7.2 ; v1(40.01,50.55) 40.01,49.8 R45.2
  Top Layer w0.6: L7.2 32.64,49.31 v1(32.64,44.96)
  Inner2 w0.254: v1(40.01,50.55) 40.01,50.93 39.12,51.82 v1(34.8,51.82)
  Bottom Layer w0.254: C45.1 37.77,41.17 37.72,41.21
  Bottom Layer w0.6: v1(32.64,44.96) 32.64,43.05 33.27,42.42 34.7,42.42 34.72,42.4 35.84,42.4 ; 35.84,42.4 36.17,42.4 36.89,43.11 DIODE_5V0_REG.1 ; 35.84,42.4 37.02,41.21 37.72,41.21
5V0_USB: length 17.8
  Top Layer w0.254: C10.2 53.88,53.32 53.88,55.06 ; DIODE_USB_5V5.3 53.38,55.56 53.88,55.06 ; USB.B4A9 49.16,61.71 49.93,62.48 53.19,62.48 53.96,61.71 USB.A4B9 v1(53.96,59.99) ; v1(52.19,57.46) 52.26,57.53 53.25,57.53 53.88,56.9 53.88,55.06
  Bottom Layer w0.254: v1(53.96,59.99) 53.96,59.23 v1(52.19,57.46)
GND: length 177.1
  Top Layer w0.254: LED6.1 41.28,33.92 v1(41.28,35.57) 42.42,35.57 LED7.1 ; U2.16 61.82,35.21 ; 61.82,35.21 v1(61.85,35.18) 60.61,33.94 U2.15 ; 61.82,35.21 60.55,36.48 U2.17 ; LED8.1 35.83,3.95 36.46,4.58 v1(36.46,7.7) 37.81,7.7 ESP.40 ; v1(17.15,44.2) 17.21,44.13 18.68,44.13 ; MICRO-SD.6 40.47,53.67 40.98,54.18 v1(40.98,54.54) ; v1(34.24,45.47) 34.75,44.95 ; 34.75,44.95 U9.1 ; 34.75,44.95 35.4,44.3 U9.2 ; 19.67,49.8 18.93,49.8 18.68,49.55 U8.9 ; 19.67,49.8 20.43,49.8 20.77,49.47 20.77,49.14 v1(21.08,48.82) 21.45,48.82 C9.1 ; 19.67,49.8 19.68,49.8 U8.7 ; v1(61.85,37.21) 63.2,35.86 68.09,35.86 ; 69.84,32.72 72.35,32.72 v1(72.39,32.77) ; C44.2 38.94,39.98 v1(39.37,39.55) ; USB.A1B12 v1(54.76,59.99) 54.76,59.35 R7.2 ; R3.1 39.99,45.47 v1(38.2,45.47) ; v1(52.19,56.52) DIODE_USB_5V5.2 ; v1(36.7,45.47) 38.65,47.42 U9.8 39.07,48.33 R46.1 ; C41.2 69.42,29.21 v1(69.47,29.26) ; C47.2 45.43,45.83 R48.1 ; v1(66.93,38.99) 66.93,39.03 C40.2 ; R8.2 48.37,59.69 v1(47.97,60.09) 47.97,60.62 USB.B1A12 ; v1(39.04,50.93) C43.1 ; v1(49.11,53.51) 48.51,54.11 DIODE_USB_3V3.2
  Top Layer w1: v1(36.7,45.47) v1(34.24,45.47)
  Bottom Layer w0.254: C34.1 67.08,20.43 v1(66.67,20.43) ; U3.23 71.88,37.88 71.25,38.51 v1(71.25,38.86) 71.25,39.25 71.88,39.88 U3.19 ; v1(30.41,26.61) 31.35,25.67 C13.2 ; v1(70.61,47.76) 70,47.16 C29.1 ; v1(70.61,47.76) 71.22,47.16 C27.1 ; v1(70.61,47.76) R18.2 ; v1(74.55,25.27) 73.1,25.27 U4.48 ; 50.41,22.83 49.58,22.83 v1(49.56,22.85) ; ENCODER.13 44.61,36.29 43.88,35.57 v1(41.28,35.57) ; v1(70.48,24.89) 70.58,24.79 U4.3 ; C20.1 41.91,39.37 v1(41.27,38.73) ; U4.9 67.58,24.45 66.29,25.75 U4.14 62.61,25.75 v1(62.33,26.03) 62.19,26.17 C32.1 ; C26.1 v1(66.55,48.06) ; v1(20.74,26.8) 20.74,26.05 22.31,24.48 22.72,24.48 22.9,24.3 22.9,23.89 MOTOR_DRV1.11 22.99,24.55 ; v1(20.74,26.8) 22.34,25.2 ; v1(20.74,26.8) 18.49,24.55 MOTOR_DRV1.20 ; v1(20.74,26.8) 18.99,28.55 MOTOR_DRV1.32 ; v1(20.74,26.8) 22.99,29.05 MOTOR_DRV1.40 ; U4.16 65.41,26.75 65.61,26.96 65.61,27.93 65.29,28.25 U4.19 63.56,28.25 v1(63.37,28.07) ; v1(66.67,20.43) 66.27,20.43 C33.1 ; v1(66.67,20.43) R37.2 ; v1(65.53,57.09) 65.65,56.97 C30.1 ; C15.2 v1(12.19,26.67) 13.93,24.93 C16.1 ; v1(67.31,43.05) 67.06,43.05 66.58,43.53 U3.3 ; MOTOR_DRV1.10 23.34,24.55 23.06,24.82 23.06,25.07 22.99,25.15 ; C45.2 v1(39.37,39.55) ; C31.1 v1(66.29,10.99) ; U4.29 68.17,32.17 68.17,31.47 69.47,30.17 v1(69.47,29.26) ; U3.16 73.28,41.38 73.61,41.71 73.61,42.05 ; U3.9 69.58,43.68 70.88,42.38 U3.14 73.28,42.38 73.61,42.05 ; 53.66,24.86 54.35,24.86 v1(54.73,25.24) ; U4.23 63.63,30.25 v1(63.52,30.36) 63.52,30.37 63.03,30.86 63.03,30.93 62.87,31.1 62.8,31.1 62.48,31.41 ; C46.2 33.78,45.01 v1(34.24,45.47) ; U3.29 69.08,36.84 v1(66.93,38.99) ; v1(49.96,39.02) 49.74,39.24 47.1,39.24 ; 50.63,10.29 v1(49.78,10.29) ; 73.61,42.05 73.75,41.91 v1(76.44,41.91) 76.96,41.39 76.96,40.09 C28.1 75.73,38.1 C25.1 ; v1(55.36,7.74) 55.27,7.83 C19.1 ; C18.1 v1(46.2,7.11) ; C35.1 v1(70.74,20.04)
  Bottom Layer w0.5: C14.2 30.41,26.65 v1(30.41,26.61)
  Bottom Layer w0.6: DIODE_5V0_REG.2 38.54,42.16 39.37,42.99 39.37,44.3 v1(38.2,45.47)
  Bottom Layer w2: 27.95,15.15 27.95,16.92 v1(31.11,20.08) v1(31.11,20.95) v1(31.11,21.82)
  vias: v1(5.59,16.76) v1(5.84,15.1) v1(6.59,16.17) v1(6.6,14.28) v1(12.52,43.69) v1(12.52,42.42) v1(13.97,43.05) v1(15.37,43.69) v1(15.37,42.42) v1(16.91,19.93) v1(17.04,21.55) v1(17.67,20.7) v1(17.71,14.55) v1(17.74,16.33) v1(18.36,15.49) v1(18.42,13.91) v1(19.05,28.45) v1(19.05,25.27) v1(22.42,28.45) v1(22.42,25.27) v1(24.36,21.72) v1(24.4,20.83) v1(24.38,19.94) v1(29.45,63.82) v1(30.29,54.12) v1(41.84,57.53) v1(42.65,30.53) v1(44.45,45.72) v1(44.97,63.82) v1(44.97,54.12) v1(46.71,16.86) v1(46.71,15.46) v1(46.71,14.06) v1(46.74,53.5) v1(48.11,16.86) v1(48.11,15.46) v1(48.11,14.06) v1(49.51,16.86) v1(49.51,15.46) v1(49.51,14.06) v1(56.01,53.21) v1(60.09,28.57) v1(63.5,43.05) v1(74.3,30.1)
VIN: length 115.9
  Top Layer w0.254: R47.1 35.31,39.62 ; U9.4 36.5,42.6 36.45,42.54 36.39,42.6 U9.3 ; U8.8 19.18,47.75 25.4,41.53 28.58,41.53
  Top Layer w1: 36.45,42.54 36.45,40.77 35.23,39.54 28.58,39.54
  Top Layer w2.3: BIG2.1 28.07,29.88 28.07,23.75 ; BIG2.1 24.64,33.31 BIG1.1 14.25,29.91 BIG4.2 14.86,20.1 14.86,15.36 ; BIG2.1 25.9,32.51 28.58,35.19 28.58,41.53 ; 28.07,23.75 27.65,24.17 23.59,24.17 21.34,21.92 BIG5.2 ; 28.07,23.75 BIG3.2 27.01,19.89 27.01,15.74 26.62,15.36
  Top Layer w3: 21.9,15.36 31.22,15.36 31.51,15.06 ; 14.86,15.36 MOSFET_C.27
  Bottom Layer w0.254: MOTOR_DRV1.5 MOTOR_DRV1.4
  Bottom Layer w0.5: C13.1 28.72,25.53 v1(26.95,27.3) ; C14.1 26.95,27.43 v1(26.95,27.3) ; v1(26.95,27.3) 26.26,27.3 26.26,27.3 23.74,27.3 ; v1(28.45,28.38) 29.45,29.38 C12.1
CAL_M: length 39.4
  Top Layer w0.254: U2.5 49.93,45.34 49.3,45.34 v1(48.06,44.1)
  Inner2 w0.254: v1(18.08,29.95) 19.1,30.97 19.1,31.36 20.04,32.29 20.59,32.29 27.03,38.73 40.45,38.73 43.06,41.34 46.09,41.34 46.43,41.69 46.43,42.47 v1(48.06,44.1)
  Bottom Layer w0.254: v1(18.08,29.95) 18.23,29.8 MOTOR_DRV1.31
CS-SD: length 34.9
  Top Layer w0.254: v1(36.58,50.8) 36.58,52.77 MICRO-SD.2 ; v1(49.78,26.93) ESP.18
  Inner2 w0.254: v1(40.13,37.85) 40.13,34.04 47.24,26.93 v1(49.78,26.93)
  Bottom Layer w0.254: v1(40.13,37.85) 40.13,45.08 36.58,48.64 v1(36.58,50.8)
CS_ENCODER: length 23.1
  Top Layer w0.254: SPI-TESTPOINT.1 44.96,26.8 45.41,26.8 46.1,26.1 v1(46.1,24.26)
  Bottom Layer w0.254: v1(46.1,24.26) 46.1,30.65 ENCODER.1
CS_MDRV: length 41.1
  Top Layer w0.254: ESP.25 40.77,25.4 40.77,24.9 v1(41.6,24.06)
  Bottom Layer w0.254: MOTOR_DRV1.29 16.54,28.55 15.42,29.67 15.42,32.69 17.15,34.42 30.35,34.42 31.62,33.15 31.62,29.34 36.12,24.84 40.83,24.84 v1(41.6,24.06)
CS_W5500_0: length 25.5
  Top Layer w0.254: ESP.10 55.68,19.17 56.77,20.26 56.77,25.02 v1(57.53,25.78)
  Bottom Layer w0.254: U3.32 67.49,35.97 67.49,36.67 67.25,36.91 66.55,36.91 66.5,36.96 64.9,36.96 60.66,32.71 60.66,31.99 57.53,28.87 v1(57.53,25.78)
CS_W5500_1: length 26.5
  Top Layer w0.254: 55.36,16.63 56.64,16.63 v1(56.64,16.64)
  Inner2 w0.254: v1(56.64,16.64) 58.17,16.64 58.62,17.09 58.62,19.06 58.79,19.23 60.18,19.23 61.47,20.51 61.47,23.32 66.83,28.68 69.71,28.68 69.73,28.7 v1(70.23,28.7)
  Bottom Layer w0.254: U4.32 69.67,32.17 69.67,31.47 70.23,30.91 v1(70.23,28.7)
ENABLE_M: length 41.4
  Top Layer w0.254: v1(48.19,45.12) 48.19,45.26 49.57,46.64 U2.4
  Inner2 w0.254: v1(17.5,29.45) 17.32,29.63 17.32,30.88 25.04,38.6 25.04,38.86 27.59,41.4 40.01,41.4 41.12,42.51 45.58,42.51 v1(48.19,45.12)
  Bottom Layer w0.254: MOTOR_DRV1.30 17.74,29.21 v1(17.5,29.45)
ETHERNET_INT_0: length 23.3
  Top Layer w0.254: v1(57.66,22.11) 57.66,19.88 55.68,17.9 ESP.9
  Bottom Layer w0.254: U3.36 58.29,28.6 58.29,22.75 v1(57.66,22.11) R19.1
ETHERNET_INT_1: length 30.3
  Top Layer w0.254: v1(62.1,22.99) 62.1,17.91 60.45,16.26 59.05,16.26 58.16,15.36 ESP.7
  Inner2 w0.254: v1(71.5,30.23) 71.5,28.7 71.07,28.27 70.63,28.27 70.47,28.12 69.99,28.12 69.83,28.27 66.99,28.27 65.69,26.96 65.69,24.73 63.94,22.99 v1(62.1,22.99)
  Bottom Layer w0.254: v1(71.5,30.23) 71.58,30.31 U4.36 ; 62.75,22.99 v1(62.1,22.99)
ETHERNET_RESET_0: length 17.6
  Top Layer w0.254: v1(55.68,44.1) 49.31,44.1
  Inner2 w0.254: v1(62.48,37.85) 56.23,44.1 v1(55.68,44.1)
  Bottom Layer w0.254: v1(62.48,37.85) 62.61,37.85 63.08,37.38 U3.37
ETHERNET_RESET_1: length 35.4
  Top Layer w0.254: v1(61.86,50.45) U2.28
  Bottom Layer w0.254: v1(61.86,50.45) 63.41,48.89 72.39,48.89 77.98,43.31 77.98,35.65 U4.37
I2C-SCL: length 79.5
  Top Layer w0.254: 20.18,44.13 20.94,44.13 v1(20.97,44.16) 21.35,43.78 R6.1 ; U2.12 v1(48.19,36.48) 47.63,35.92 47.63,25.91 47.24,25.53
  Inner2 w0.254: SCREEN.1 76.48,36.73 62.2,36.73 62.09,36.63 48.33,36.63 v1(48.19,36.48)
  Bottom Layer w0.254: v1(48.19,36.48) 47.61,35.91 47.59,35.91 47.3,35.62 46.16,35.62 45.24,34.7 39.85,34.7 37.97,36.58 32.26,36.58 29.06,39.78 28.93,39.78 28.36,40.35 27.71,40.35 27.01,41.04 27.01,41.69 25.05,43.65 21.48,43.65 v1(20.97,44.16)
I2C-SDA: length 78.5
  Top Layer w0.254: 19.68,43.86 19.68,43.1 20,42.77 20.73,42.77 20.65,42.7 v1(20.63,42.7) 21.03,42.29 R5.1 ; U2.13 48.57,35.21 v1(48.31,34.96) 48.31,34.82 48.36,34.77 48.36,25.68 ESP.19
  Inner2 w0.254: v1(48.31,34.96) 49.12,35.76 78.05,35.76 SCREEN.2
  Bottom Layer w0.254: v1(48.31,34.96) 46.07,34.96 45.41,34.29 39.68,34.29 39.43,34.04 34.1,34.04 28.19,39.94 27.54,39.94 26.61,40.87 26.61,41.52 24.89,43.25 21.9,43.25 21.35,42.7 v1(20.63,42.7)
IN_MHIGH_A: length 36.7
  Top Layer w0.254: v1(39.13,9.39) 38.75,9.01 ESP.39
  Inner2 w0.254: v1(19.69,31.11) 19.69,30.36 23.08,26.96 26.12,26.96 26.8,26.29 28.19,26.29 34.47,20.02 34.47,11.51 36.58,9.39 v1(39.13,9.39)
  Bottom Layer w0.254: MOTOR_DRV1.34 19.99,30.81 v1(19.69,31.11)
IN_MHIGH_B: length 27
  Top Layer w0.254: ESP.34 37.54,15.68 v1(36.52,15.68)
  Inner2 w0.254: v1(36.52,15.68) 35.28,16.92 35.28,20.37 26.21,29.44 22.25,29.44 21.08,30.61 v1(21.08,31.11)
  Bottom Layer w0.254: MOTOR_DRV1.36 20.99,31.02 v1(21.08,31.11)
IN_MHIGH_C: length 24.7
  Top Layer w0.254: ESP.32 37.73,18.03 v1(36.59,18.03)
  Inner2 w0.254: v1(36.59,18.03) 36.59,18.54 36.09,19.03 36.09,22.33 27.94,30.48 22.99,30.48 v1(22.35,31.11)
  Bottom Layer w0.254: MOTOR_DRV1.38 21.99,30.62 22.12,30.76 22.12,30.89 v1(22.35,31.11)
IN_MLOW_A: length 30
  Top Layer w0.254: v1(36.59,14.09) ESP.35
  Inner2 w0.254: v1(20.32,31.71) 20.32,30.61 21.89,29.03 26.04,29.03 34.87,20.2 34.87,16.5 36.59,14.78 v1(36.59,14.09)
  Bottom Layer w0.254: v1(20.32,31.71) 20.49,31.53 MOTOR_DRV1.35
IN_MLOW_B: length 27.5
  Top Layer w0.254: 37.86,16.63 37.73,16.76 v1(36.59,16.76)
  Inner2 w0.254: v1(21.72,31.71) 21.77,31.66 21.77,30.87 22.8,29.84 28,29.84 35.69,22.16 35.69,17.66 v1(36.59,16.76)
  Bottom Layer w0.254: MOTOR_DRV1.37 21.49,30.7 21.72,30.92 v1(21.72,31.71)
IN_MLOW_C: length 23.9
  Top Layer w0.254: ESP.31 37.73,19.3 v1(36.72,19.3)
  Inner2 w0.254: v1(22.99,31.71) 23.81,30.89 28.11,30.89 36.5,22.5 36.5,19.52 v1(36.72,19.3)
  Bottom Layer w0.254: v1(22.99,31.71) 22.94,31.66 22.94,30.87 22.49,30.43 MOTOR_DRV1.39
INA-ALERT: length 37.6
  Top Layer w0.254: 21.27,41.35 20.85,41.35 19.18,43.03 19.18,43.86 ; R2.1 21.35,41.12 v1(21.2,41.27) ; v1(50.22,50.07) 50.22,50.2 U2.1
  Inner2 w0.254: v1(50.22,50.07) 50.09,50.2 43.34,50.2 42.53,49.39 41.61,49.39 39.21,46.99 27.94,46.99 22.23,41.27 v1(21.2,41.27)
NFAULT_M: length 47.7
  Top Layer w0.254: v1(47.42,46.39) 48.04,46.39 49.57,47.91 U2.3
  Inner2 w0.254: v1(16.76,26.55) 16.92,26.71 16.92,31.05 24.64,38.77 24.64,39.88 31.11,46.35 47.39,46.35 v1(47.42,46.39)
  Bottom Layer w0.254: R9.2 15.8,26.54 16.75,26.54 v1(16.76,26.55) MOTOR_DRV1.25
RXN_0: length 10.2
  Top Layer w0.254: v1(67.66,46.13) 69.69,46.13 73.15,42.67 73.15,41.53
  Bottom Layer w0.254: 67.56,46.49 67.56,44.39 U3.5
RXN_1: length 9.3
  Top Layer w0.254: v1(69.72,22.32) 68.36,22.32 66.04,24.64 65.7,24.64 64.39,25.95 64.39,26.29
  Bottom Layer w0.254: R35.1 v1(69.72,22.32) 69.72,22.48 69.58,22.62 U4.5
RXP_0: length 8.5
  Top Layer w0.254: v1(70.1,40.51) 70.48,40.89 L3.6
  Bottom Layer w0.254: v1(70.1,40.51) 68.96,41.66 68.96,42.8 68.07,43.68 68.07,44.38 U3.6 68.07,44.39 68.07,45.59 68.58,46.1 R21.1
RXP_1: length 6.3
  Top Layer w0.254: 66.93,26.29 66.93,25.53 67.49,24.96 v1(68.52,24.96)
  Bottom Layer w0.254: v1(68.52,24.96) 68.7,24.78 68.76,24.78 69,24.54 69,24.48 69.09,24.39 69.09,23.76 U4.6 69.09,23.75 69.09,22.73 68.71,22.35 R34.1
SD-CD: length 15.1
  Top Layer w0.254: v1(48.19,49.05) 49.84,49.05 U2.2 ; MICRO-SD.9 43.82,53.32 43.82,54.36 v1(43.56,54.61)
  Bottom Layer w0.254: v1(48.19,49.05) 49.25,50.11 49.25,51.47 48.51,52.2 47.63,52.2 46.9,52.92 46.23,52.92 45.87,53.27 MICRO-SD.9 ; MICRO-SD.9 43.77,52.42 R38.1 ; MICRO-SD.9 43.77,54.4 v1(43.56,54.61)
SOA_M: length 53
  Top Layer w0.254: v1(45.08,10.67) 47.37,12.95 50.03,12.95 51.17,14.09 ESP.6
  Inner2 w0.254: v1(45.08,10.67) 45.08,10.54 43.35,8.81 38.48,8.81 38.1,8.43 36.97,8.43 36.59,8.81 33.5,8.81 30.39,11.92 29.91,11.92 29.53,11.54 28.34,11.54 24.87,15.01 24.87,15.65 24.86,15.66 24.86,17.43 24.87,17.44 24.87,18.59 21.1,22.35 21.1,23.28 19.7,24.69 18.81,24.69 17.88,25.62 16.81,25.62 16.43,25.24
  Bottom Layer w0.254: v1(16.43,25.24) 16.64,25.44 17.14,25.44 arc(17.27,25.46) 17.39,25.53 17.4,25.54 17.62,25.54 17.63,25.53 arc(17.69,25.53) 17.74,25.54 MOTOR_DRV1.23
SOB_M: length 52.8
  Top Layer w0.254: v1(45.85,9.65) 47.3,9.65 50.47,12.82 ESP.5
  Inner2 w0.254: v1(16.62,24.22) 18.7,24.22 20.19,22.73 20.19,17.39 26.44,11.13 29.71,11.13 33.73,7.11 43.31,7.11 v1(45.85,9.65)
  Bottom Layer w0.254: MOTOR_DRV1.22 17.65,24.95 17.24,24.95 16.62,24.33 v1(16.62,24.22)
SOC_M: length 53.2
  Top Layer w0.254: 55.36,11.55 49.78,11.55 v1(47.12,8.89)
  Inner2 w0.254: v1(16.4,23.32) 16.78,22.94 19.17,22.94 19.51,22.59 19.51,19.44 18.97,18.91 18.97,18.03 26.28,10.73 28.99,10.73 33.01,6.71 44.93,6.71 v1(47.12,8.89)
  Bottom Layer w0.254: v1(16.4,23.32) 16.72,23.64 16.86,23.64 17.2,23.98 17.2,24.12 17.63,24.55 MOTOR_DRV1.21
SPI_CLK_0: length 66.6
  Top Layer w0.254: v1(44.96,23.5) 44.96,25.78 37.85,32.89 SPI-TESTPOINT.2
  Bottom Layer w0.254: MOTOR_DRV1.28 17.65,27.95 16.18,27.95 15.01,29.12 15.01,32.86 16.98,34.82 30.52,34.82 32.03,33.32 32.03,32.3 32.92,31.41 32.92,28.69 35.43,26.18 40.36,26.18 43.05,23.5 v1(44.96,23.5) 44.96,30.34 44.78,30.52 44.78,31.32 ENCODER.2
SPI_CLK_1: length 81.7
  Top Layer w0.254: v1(40.13,54.54) 39.37,53.78 MICRO-SD.5 ; v1(58.93,32.89) 63.25,32.89 65.02,34.67 66.69,34.67 66.89,34.87 67.38,34.87 67.58,34.68 v1(69.79,34.68) ; 55.36,21.71 55.03,21.71 54.92,21.6 v1(54.1,21.6)
  Inner2 w0.254: v1(40.13,54.54) 40.13,53.76 39.89,53.51 39.89,53.03 40.64,52.28 49.73,52.28 51.03,50.98 53.8,50.98 53.98,50.8 ; v1(54.1,21.6) 54.1,22.11 55.93,23.93 55.93,30.4 58.42,32.89 v1(58.93,32.89)
  Bottom Layer w0.254: v1(54.1,50.67) 53.85,50.42 53.85,26.95 55.69,25.11 55.69,23.69 54.1,22.11 v1(54.1,21.6) ; U3.33 67.06,35.86 67.06,35.2 67.58,34.68 v1(69.79,34.68) 69.79,33.25 70.08,32.95 U4.33
SPI_MISO_0: length 53.6
  Top Layer w0.254: SPI-TESTPOINT.3 39.24,30.35 43.31,26.29 43.31,25.33 44.07,24.57 v1(44.07,24.13)
  Bottom Layer w0.254: 15.21,27.59 15.05,27.43 14.72,27.43 ; 15.21,27.59 14.12,28.68 14.12,33.43 16.51,35.81 30.68,35.81 36.14,30.35 SPI-TESTPOINT.3 ; 15.21,27.59 15.66,27.14 17.65,27.14 MOTOR_DRV1.26 ; ENCODER.3 43.96,24.25 v1(44.07,24.13)
SPI_MISO_1: length 79.5
  Top Layer w0.254: MICRO-SD.7 41.57,53.76 41.95,54.14 v1(41.95,54.54) ; v1(67.14,34.29) 66.88,34.29 66.86,34.26 66.25,34.26 64.22,32.23 v1(60.07,32.23) ; v1(54.11,20.44) 54.32,20.24 55.16,20.24 ESP.11
  Inner2 w0.254: v1(54.86,51.43) 54.74,51.56 53.33,51.56 52.19,52.7 50.62,52.7 50.6,52.69 43.53,52.69 43.19,53.03 43.19,53.31 v1(41.95,54.54) ; v1(54.11,20.44) 54.11,20.78 56.77,23.44 56.77,28.93 v1(60.07,32.23) ; v1(67.14,34.29) 67.39,34.54 69.1,34.54 69.55,34.09 70.31,34.09 v1(70.48,34.27)
  Bottom Layer w0.254: v1(54.11,20.44) 54.11,20.78 56.35,23.02 56.35,25.02 54.86,26.51 v1(54.86,51.43) ; U3.34 66.65,35.81 66.65,34.78 v1(67.14,34.29) ; v1(70.48,34.27) 70.58,34.17 U4.34
SPI_MOSI_0: length 52.3
  Top Layer w0.254: v1(43.18,24.2) 42.88,24.5 42.87,24.5 42.42,24.95 42.42,25.28 ESP.24
  Bottom Layer w0.254: MOTOR_DRV1.27 16.01,27.55 14.61,28.96 14.61,33.27 16.74,35.41 30.51,35.41 33.78,32.14 33.78,31.38 36.32,28.84 SPI-TESTPOINT.4 39.57,27.81 v1(43.18,24.2) 43.31,24.32 ENCODER.4
SPI_MOSI_1: length 72.4
  Top Layer w0.254: ESP.17 51.07,25.55 v1(51.07,26.95) ; v1(37.17,54.54) MICRO-SD.3
  Inner2 w0.254: v1(71.17,33.65) 71.14,33.69 69.38,33.69 68.93,34.14 67.82,34.14 67.34,33.65 v1(66.46,33.65) 53.47,33.65 51.07,31.26 v1(51.07,26.95) ; v1(37.17,54.54) 37.27,54.54 39.94,51.87 49.56,51.87 51.56,49.87 51.56,48.64
  Bottom Layer w0.254: U4.35 71.08,33.57 v1(71.17,33.65) ; v1(66.46,33.65) 66.08,34.04 U3.35 ; v1(51.51,48.64) 52.2,47.96 52.2,28.04 51.07,26.91 v1(51.07,26.95)
TXN_0: length 5.6
  Top Layer w0.254: L3.3 66.67,42.54 v1(66.17,43.05)
  Bottom Layer w0.254: R22.1 64.52,45.44 U3.1 65.53,44.34 65.53,43.72 66.17,43.09 v1(66.17,43.05)
TXN_1: length 5.4
  Top Layer w0.254: 70.74,26.29 71.3,25.73 v1(71.3,25.02)
  Bottom Layer w0.254: v1(71.3,25.02) 71.58,24.73 U4.1 71.58,23.25 72.77,22.06 R33.1
TXP_0: length 7.2
  Top Layer w0.254: 64.26,41.53 64.26,43.78 v1(66.08,45.6)
  Bottom Layer w0.254: R23.1 66.08,45.95 v1(66.08,45.6) U3.2
TXP_1: length 7
  Top Layer w0.254: 73.28,26.29 73.28,23.97 v1(71.64,22.34)
  Bottom Layer w0.254: R32.1 71.76,22.34 v1(71.64,22.34) 71.08,22.9 U4.2
USB_NEG: length 42.6
  Top Layer w0.254: USB.B7 52.32,61 52.32,60.4 52.08,60.16 51.55,60.16 51.31,60.39 USB.A7 ; v1(50.8,56.9) 50.8,55.69 51.31,55.18 v1(51.31,51.56)
  Bottom Layer w0.254: v1(51.82,59.94) 50.8,58.93 v1(50.8,56.9) ; v1(51.31,51.56) 51.48,51.56 51.54,51.5 51.54,50.57 52.6,49.5 52.6,25.55 51.86,24.81 51.86,23.02 ; 51.86,23.02 51.67,22.84 CAP_USB_N.2 ; 51.86,23.02 52.04,22.84 R11.1
USB_POS: length 40.8
  Top Layer w0.254: USB.A6 51.82,61.01 51.82,61.63 51.56,61.89 51.05,61.89 50.81,61.65 USB.B6 50.81,60.12 51.56,59.37 v1(51.56,58.7) ; v1(51.94,52.12) 51.94,55.37 v1(51.56,55.75)
  Bottom Layer w0.254: R14.1 53.1,24.84 CAP_USB_P.2 53.2,24.95 53.2,25.14 53.34,25.28 53.34,50.16 52.45,51.05 52.45,51.61 v1(51.94,52.12) ; v1(51.56,55.75) v1(51.56,58.7)
$1N21: length 14.3
  Top Layer w0.254: 18.18,50.15 POWER_INPUT.1 ; 18.18,50.15 U8.10 ; 18.18,50.15 18.7,50.67 20.33,50.67 v1(21.35,49.66)
  Top Layer w5: POWER_INPUT.1 13.97,50.89 13.97,48.39
  Bottom Layer w0.254: v1(21.35,49.66) R16.2
$1N28: length 2
  Top Layer w0.254: USB.B5 49.81,59.97 49.53,59.69 R8.1
$1N29: length 2.7
  Top Layer w0.254: R7.1 53.47,59.18 52.81,59.84 USB.A5
$1N46: length 14.5
  Top Layer w0.254: DIODE_USB_3V3.1 47.55,54.59 v1(47.07,54.59) ; 49.46,54.61 v1(50.1,54.61)
  Inner2 w0.254: v1(47.07,54.59) 45.03,56.63 v1(45.03,57.53)
  Bottom Layer w0.254: v1(47.07,54.59) 48.28,55.81 U5.2 50.1,54.82 v1(50.1,54.61) 53.84,54.61 U5.4
$1N52: length 7.4
  Top Layer w3.8: Q2.2 26.85,48.68 POWER_INPUT.2
$1N53: length 13.2
  Inner2 w0.254: v1(26.92,43.43) 26.92,43.09 v1(24.56,40.73)
  Bottom Layer w0.254: v1(26.92,43.43) 26.92,47.88 25.15,49.66 R16.1
$1N3919: length 1.7
  Top Layer w0.254: 41.53,41.77 R3.2
$1N8597: length 1.6
  Top Layer w0.254: C42.2 36.7,49.89 U9.11
$1N8601: length 2.6
  Top Layer w1: L7.1 35.62,50.65 35.62,50.4 35.69,50.34 35.69,48.51
$1N8664: length 2.7
  Top Layer w0.254: C43.2 37.35,50.71 U9.10
$1N8745: length 3.7
  Top Layer w0.254: R46.2 39.99,48.99 39.49,49.49 39.49,49.77 R45.1 38.77,49.78 38,49.01 U9.9
$1N8854: length 3.1
  Top Layer w0.254: U9.5 37.35,39.91 R47.2
$1N8916: length 2.3
  Top Layer w0.254: U9.6 38,41.01 C44.1
$1N9309: length 1.7
  Top Layer w0.254: LED9.1 43.85,44.94 R48.2
$2N19: length 10.3
  Inner2 w0.254: v1(16.33,29.59) 13.43,32.5 v1(13.08,32.5)
  Bottom Layer w0.254: v1(13.08,32.5) 12.19,31.61 C15.1 ; MOTOR_DRV1.33 19.4,29.89 19.4,29.97 19.38,29.98 19.38,30.31 19.16,30.53 17.27,30.53 v1(16.33,29.59)
$2N21: length 1.7
  Bottom Layer w0.254: MOTOR_DRV1.2 24.9,28.55 C11.2
$2N22: length 1.8
  Bottom Layer w0.254: MOTOR_DRV1.1 24.49,29.05 25.2,29.76 C11.1
$2N24: length 26.2
  Top Layer w0.254: v1(9.3,18.34) 9.3,20.3 MOSFET-TESTPOINT.14
  Top Layer w1: 9.07,17.78 9.3,18 v1(9.3,18.34) ; 12.57,18.06 12.57,18.31 v1(12.6,18.34)
  Top Layer w2: v1(10.08,18.34) v1(11.8,18.34)
  Bottom Layer w0.254: MOTOR_DRV1.19 18.99,23.39 17.86,22.26 16.52,22.26 v1(12.6,18.34)
  Bottom Layer w1: v1(9.3,18.34) v1(10.08,18.34)
  Bottom Layer w2: v1(11.8,18.34) v1(12.6,18.34)
  Bottom Layer w3: v1(10.08,18.34) 12.2,16.22 12.2,15.49
$2N25: length 47.8
  Top Layer w0.254: MOSFET_C.1 7.8,11.86 v1(7.75,11.81)
  Inner2 w0.254: v1(7.75,11.81) 7.52,12.04 6.05,12.04 2.51,15.58 2.51,31.85 3.81,33.15 MOSFET-TESTPOINT.11
  Bottom Layer w0.254: v1(7.75,11.81) 8.08,11.48 14.09,11.48 15.01,12.4 15.01,16.28 20.49,21.76 MOTOR_DRV1.16
$2N26: length 55.4
  Top Layer w0.254: v1(16.95,12.26) 19.05,12.26 19.4,12.6 MOSFET_B.1
  Inner2 w0.254: v1(16.95,12.26) 15.75,11.05 7.75,11.05 7.57,11.23 6.29,11.23 2.11,15.41 2.11,32.02 3,32.91 3,33.59 4.06,34.66 MOSFET-TESTPOINT.10
  Bottom Layer w0.254: MOTOR_DRV1.15 20.99,21.63 15.62,16.26 15.62,13.59 v1(16.95,12.26)
$2N27: length 61.5
  Top Layer w0.254: v1(19.39,11.62) 19.9,12.13 MOSFET_B.2
  Inner2 w0.254: MOSFET-TESTPOINT.9 1.65,35.81 1.65,17.53 1.7,17.47 1.7,15.24 6.3,10.64 15.92,10.64 16.89,11.62 v1(19.39,11.62)
  Bottom Layer w0.254: MOTOR_DRV1.14 21.49,21.46 16.38,16.35 16.38,13.72 18.48,11.62 v1(19.39,11.62)
$2N28: length 73.9
  Top Layer w0.254: MOSFET-TESTPOINT.8 3.18,40.77 2.79,40.39 2.79,27.37 2.01,26.58 2.01,14.38 5.97,10.41 11.55,10.41 16.05,5.91 16.05,5 16.89,4.16 18.07,4.16 18.91,5 18.91,6.18 15.59,9.49 15.59,13.58 16.64,14.62 16.64,16.45 18.05,17.86 18.75,17.86 19.4,18.51 ; 19.4,18.51 v1(19.56,18.67) ; 19.4,18.51 MOSFET_B.22
  Bottom Layer w0.254: v1(19.56,18.67) 21.99,21.1 MOTOR_DRV1.13
$2N29: length 70.3
  Top Layer w1: 24.07,17.65 24.07,18.23 v1(24.11,18.27) ; 20.7,17.65 20.77,17.72 v1(20.77,18.27)
  Top Layer w2: v1(23.19,18.27) v1(22.4,18.27) v1(21.52,18.27)
  Bottom Layer w0.254: v1(22.4,18.27) 22.49,18.36 MOTOR_DRV1.12 ; v1(20.77,18.27) 19.75,17.24 19.75,13.47 19.58,13.31 19.58,12.25 19.97,11.86 19.97,11.38 19.63,11.04 4.97,11.04 2.54,13.46 2.54,41.78 MOSFET-TESTPOINT.7
  Bottom Layer w1: v1(23.19,18.27) v1(24.11,18.27) ; v1(20.77,18.27) v1(21.52,18.27)
  Bottom Layer w3: v1(22.4,18.27) 22.4,16.72 23.8,15.31
$2N31: length 97.6
  Top Layer w1: 33.26,18.05 v1(33.26,18.56) ; 33.26,18.05 33.26,18.04 33.01,17.79 32.51,18.29 32.01,17.79 ; 33.26,18.05 33.51,17.79 ; 30.51,17.79 31.01,17.79
  Top Layer w2: 33.61,18.56 v1(33.26,18.56) v1(32.51,18.56) 32.24,18.29 31.11,18.29
  Inner2 w0.254: v1(32.51,18.56) 30.08,18.56 v1(26.29,22.35)
  Bottom Layer w0.254: MOSFET-TESTPOINT.4 4.06,50.67 2.13,48.74 2.13,13.29 3.38,12.05 3.38,11.99 3.56,11.81 3.62,11.81 7.81,7.62 27.81,7.62 33.29,13.1 33.29,15.15 ; MOTOR_DRV1.9 24.36,25.05 26.29,23.11 v1(26.29,22.35)
  Bottom Layer w2.5: v1(33.88,18.56) 33.29,17.96 33.29,15.15
$2N32: length 100.3
  Top Layer w0.254: v1(26.54,12.06) 23.91,9.43 23.91,5 22.67,3.75 16.72,3.75 15.64,4.83 15.64,5.75 11.48,9.91 6.48,9.91 6.38,10.01 5.8,10.01 1.6,14.21 1.6,26.75 2.39,27.54 2.39,40.55 2.79,40.96 2.79,52.2 MOSFET-TESTPOINT.3 ; v1(29.72,22.52) 29.72,19.18 29.01,18.47 29.01,17.67
  Bottom Layer w0.254: v1(26.54,12.06) 26.54,19.34 v1(29.72,22.52) 27.04,25.2 25.1,25.2 24.74,25.55 MOTOR_DRV1.8
$2N33: length 95.5
  Top Layer w0.254: MOSFET_A.2 29.53,12.95 29.53,12.37 v1(29.51,12.35) ; MOSFET-TESTPOINT.2 4.06,54.98 3,53.91 3,52.97 2.39,52.37 2.39,41.13 1.98,40.72 1.98,27.71 1.19,26.92 1.19,14.04 5.73,9.5 7.77,9.5 v1(9.02,8.25)
  Inner2 w0.254: v1(25.27,25.91) 25.27,15.18 28.51,11.95 28.99,11.95 29.39,12.35 v1(29.51,12.35)
  Bottom Layer w0.254: v1(25.27,25.91) 25.13,26.05 MOTOR_DRV1.7 ; v1(29.51,12.35) 29.51,10.21 27.56,8.25 v1(9.02,8.25)
$2N34: length 96.7
  Top Layer w0.254: v1(28.75,12.53) 29.01,12.79 29.01,12.97 ; v1(10.41,8.89) 9.6,8.08 9.6,8.01 9.26,7.67 6.99,7.67 0.79,13.87 0.79,15.47 0.76,15.49 0.76,55.24 MOSFET-TESTPOINT.1
  Inner2 w0.254: v1(25.88,26.38) 26.05,26.21 26.05,25.54 25.7,25.2 25.7,15.58 v1(28.75,12.53)
  Bottom Layer w0.254: v1(10.41,8.89) 25.11,8.89 v1(28.75,12.53) ; MOTOR_DRV1.6 25.71,26.55 v1(25.88,26.38)
$2N35: length 12.1
  Top Layer w1: 32.01,12.84 MOSFET_A.8 MOSFET_A.10 ; 32.01,12.84 MOSFET_A.6 MOSFET_A.4 ; 32.01,12.84 32.01,10.12 MOTOR_TERMINAL.3
$2N36: length 10.2
  Top Layer w1: MOSFET_B.7 MOSFET_B.8 MOSFET_B.9 MOSFET_B.10 ; MOSFET_B.7 22.4,5.67 MOTOR_TERMINAL.2 ; MOSFET_B.7 MOSFET_B.6 MOSFET_B.5 MOSFET_B.4
$2N37: length 13.1
  Top Layer w1: MOSFET_C.4 MOSFET_C.5 MOSFET_C.6 MOSFET_C.7 ; MOSFET_C.10 MOSFET_C.9 MOSFET_C.8 MOSFET_C.7 ; MOSFET_C.7 10.8,12.27 MOTOR_TERMINAL.1
$2N47: length 43.5
  Top Layer w0.254: MOSFET_C.2 8.3,12.28 8.51,12.06 v1(8.64,12.06)
  Inner2 w0.254: MOSFET-TESTPOINT.12 2.92,29.46 2.92,15.75 6.22,12.45 8.26,12.45 v1(8.64,12.06)
  Bottom Layer w0.254: MOTOR_DRV1.17 19.99,21.9 14.61,16.51 14.61,12.57 13.97,11.94 8.76,11.94 v1(8.64,12.06)
$2N48: length 28.6
  Top Layer w0.254: MOSFET-TESTPOINT.13 2.41,26.42 2.41,22.35 3.56,21.21 5.27,21.21 v1(7.89,18.59) 7.8,18.49 MOSFET_C.22
  Inner2 w0.254: v1(7.89,18.59) 11.65,22.35 v1(18.92,22.35)
  Bottom Layer w0.254: MOTOR_DRV1.18 19.49,22.92 v1(18.92,22.35)
$2N493: length 4.3
  Bottom Layer w0.254: MOTOR_DRV1.3 26.03,28.05 C12.2
$3N13: length 1.9
  Top Layer w0.254: v1(54.22,24.25) ESP.14
  Bottom Layer w0.254: v1(54.22,24.25) 53.84,23.88 R14.2
$3N14: length 2.4
  Top Layer w0.254: ESP.13 55.03,22.98 54.91,22.86 v1(53.87,22.86)
  Bottom Layer w0.254: 52.97,22.86 53.79,22.86 53.8,22.87
$3N15: length 74
  Top Layer w0.254: RESET.2 73.92,38.1 80.77,38.1 82.55,36.32 82.55,29.97 77.79,25.21 77.79,6.29 75.06,3.56 74.23,3.56 74.2,3.53 72.61,3.53 72.58,3.56 61.53,3.56 61.51,3.53 59.91,3.53 58.78,4.66 58.78,6.86 56.9,8.75 56.9,9.53 56.14,10.28 v1(55.36,10.28)
  Bottom Layer w0.254: C17.2 52.31,10.29 52.34,10.32 52.57,10.32 R12.1 52.67,10.32 55.32,10.32 v1(55.36,10.28)
